# EAGLE design Joulev2_RealTime (EAGLE 8.1.1)

## Sheet 1 of 3
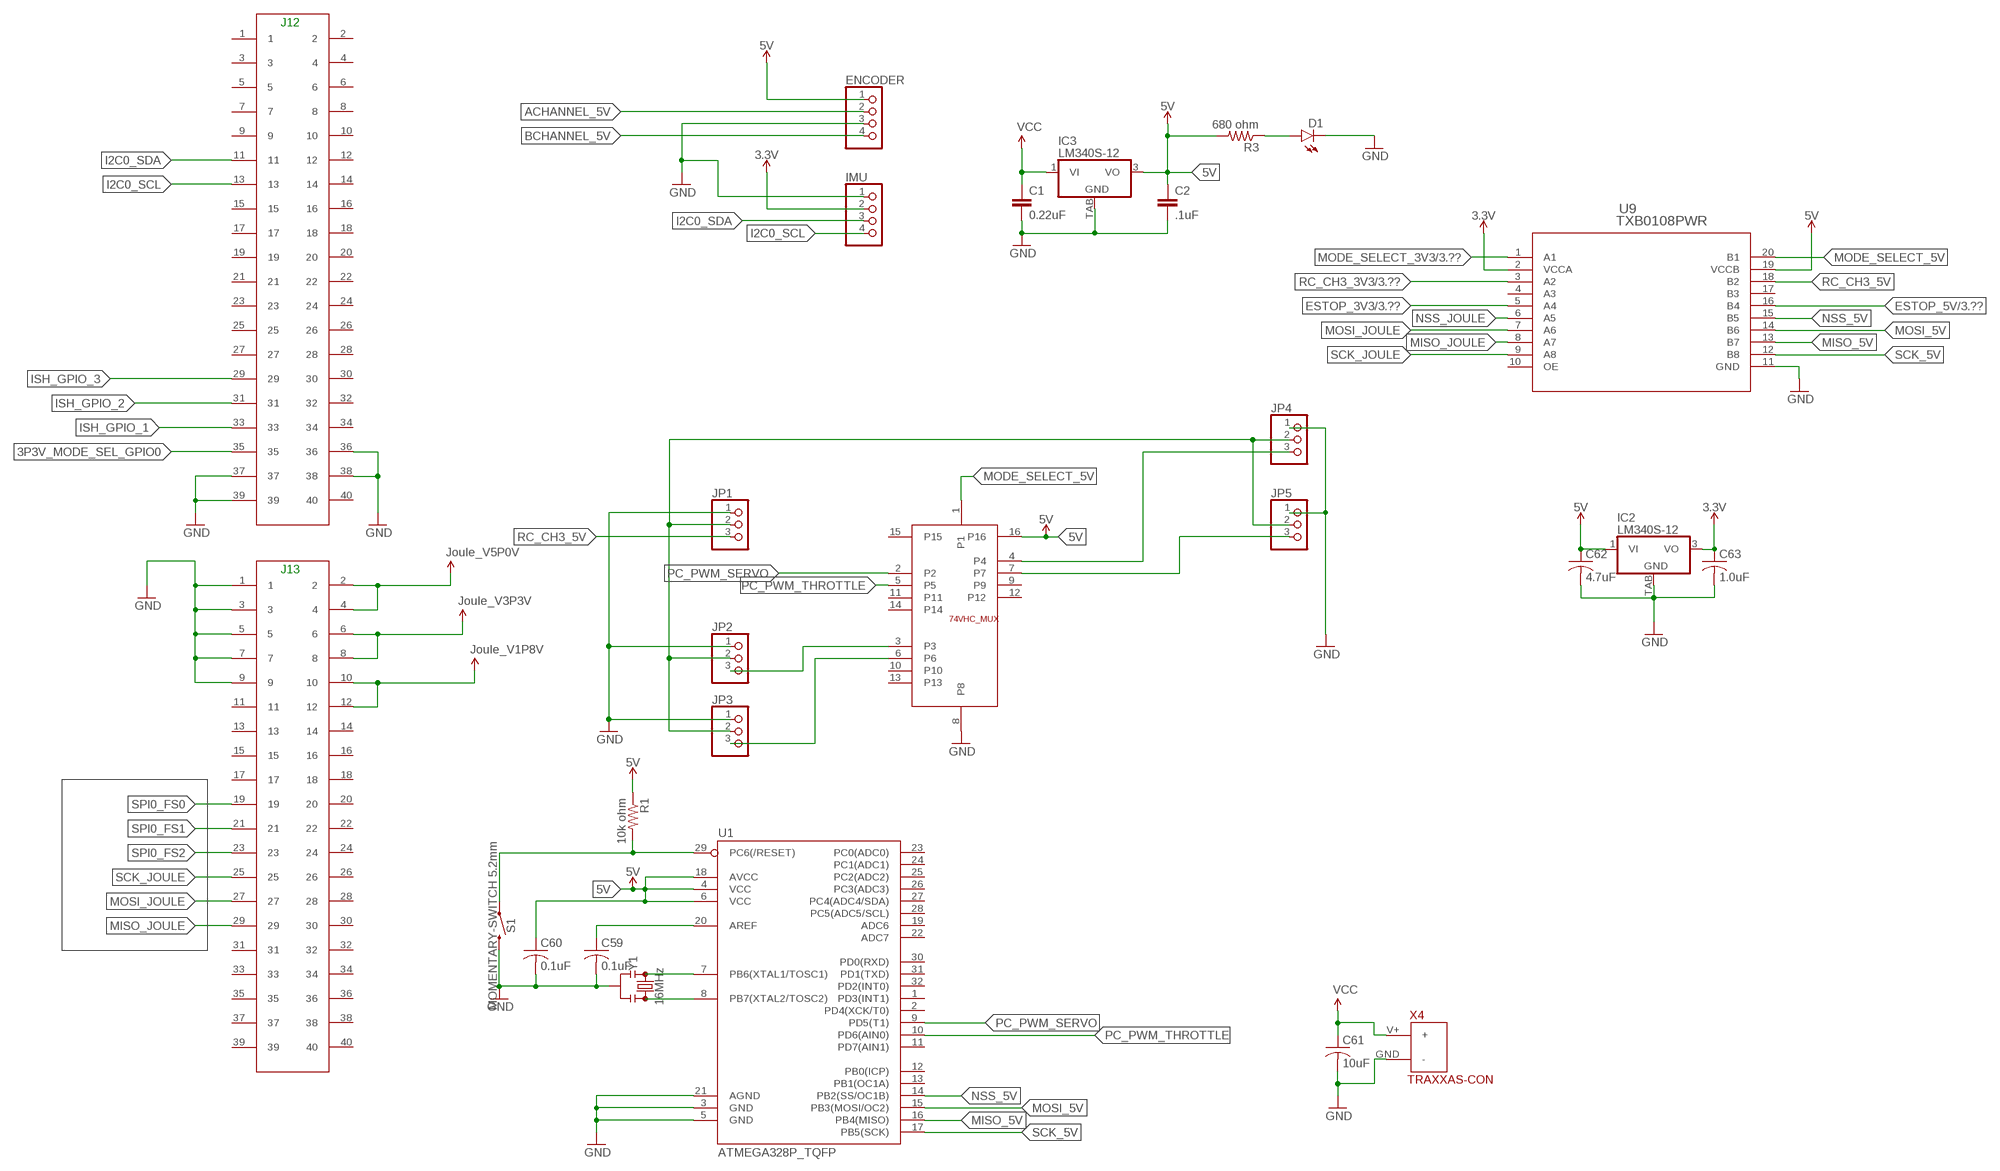
[diagram p0: schematic, sheet 1]

### Parts
C1  0.22uF  0.22UF-25V-10%(0603)  [0603-CAP]
C2  .1uF  0.22UF-25V-10%(0603)  [0603-CAP]
C59  0.1uF  C-USC0603  [C0603]
C60  0.1uF  C-USC0603  [C0603]
C61  10uF  C-USC0603  [C0603]
C62  4.7uF  C-USC0603  [C0603]
C63  1.0uF  C-USC0603  [C0603]
D1  LED0603  [LED-0603]
ENCODER  PINHD-1X4  [1X04]
IC2  LM340S-12  [TO263-3]
IC3  LM340S-12  [TO263-3]
IMU  PINHD-1X4  [1X04]
JP1  PINHD-1X3  [1X03]
JP2  PINHD-1X3  [1X03]
JP3  PINHD-1X3  [1X03]
JP4  PINHD-1X3  [1X03]
JP5  PINHD-1X3  [1X03]
R1  10k ohm  R-US_R0603  [R0603]
R3  680 ohm  R-US_R0603  [R0603]
S1  MOMENTARY-SWITCH 5.2mm  MOMENTARY-SWITCH-SPST-SMD-5.2MM  [TACTILE_SWITCH_SMD_5.2MM]
U1  ATMEGA328P_TQFP  [TQFP32-08]
U2  74VHC_MUXSO16  [SO16]
U9  TXB0108PWR  [PW20]
X1  J12HEADER_(JOULE)  [2X20]
X2  J13HEADER_(JOULE)  [2X20]
X4  TRAXXAS-CON  [TRAXXAS-CON]
Y1  16MHz  RESONATOR-16MHZSMD_3.2X1.3  [RESONATOR-SMD-3.2X1.3]

### Nets
3.3V: C63.1 IC2.3(VO) IMU.2 U9.2(VCCA) ; also sheet 2,3
3P3V_MODE_SEL_GPIO0: X1.35
5V: C2.1 C60.1 C62.1 ENCODER.1 IC2.1(VI) IC3.3(VO) R1.1 R3.2 U1.4(VCC) U1.6(VCC) U1.18(AVCC) U2.16 U9.19(VCCB)
ACHANNEL_5V: ENCODER.2
BCHANNEL_5V: ENCODER.4
ESTOP_3V3: U9.5(A4) ; also sheet 3
ESTOP_5V: U9.16(B4) ; also sheet 3
GND: C1.2 C2.2 C59.2 C60.2 C61.2 C62.2 C63.2 D1.C ENCODER.3 IC2.TAB(GND) IC3.TAB(GND) IMU.1 JP1.1 JP2.1 JP3.1 JP4.1 JP5.1 S1.3 U1.3(GND) U1.5(GND) U1.21(AGND) U2.8 U9.11(GND) X1.36 X1.37 X1.38 X1.39 X2.1 X2.3 X2.5 X2.7 X2.9 X4.GND(-) Y1.2 ; also sheet 2,3
I2C0_SCL: IMU.4 X1.13
I2C0_SDA: IMU.3 X1.11
ISH_GPIO_1: X1.33
ISH_GPIO_2: X1.31
ISH_GPIO_3: X1.29
MISO_5V: U1.16(PB4(MISO)) U9.13(B7)
MISO_JOULE: U9.8(A7) X2.29
MODE_SELECT_3V3: U9.1(A1) ; also sheet 3
MODE_SELECT_5V: U2.1 U9.20(B1)
MOSI_5V: U1.15(PB3(MOSI/OC2)) U9.14(B6)
MOSI_JOULE: U9.7(A6) X2.27
N$2: JP4.3 U2.4
N$3: JP5.3 U2.7
N$4: R1.2 S1.1 U1.29(PC6(/RESET))
N$6: U1.7(PB6(XTAL1/TOSC1)) Y1.1
N$7: JP1.2 JP2.2 JP3.2 JP4.2 JP5.2
N$8: U1.8(PB7(XTAL2/TOSC2)) Y1.3
N$10: JP2.3 U2.3
N$11: JP3.3 U2.6
N$13: C59.1 U1.20(AREF)
N$20: D1.A R3.1
NSS_5V: U1.14(PB2(SS/OC1B)) U9.15(B5)
NSS_JOULE: U9.6(A5)
PC_PWM_SERVO: U1.9(PD5(T1)) U2.2
PC_PWM_THROTTLE: U1.10(PD6(AIN0)) U2.5
RC_CH3_3V3: U9.3(A2) ; also sheet 3
RC_CH3_5V: JP1.3 U9.18(B2)
SCK_5V: U1.17(PB5(SCK)) U9.12(B8)
SCK_JOULE: U9.9(A8) X2.25
SPI0_FS0: X2.19
SPI0_FS1: X2.21
SPI0_FS2: X2.23
V1P8V: X2.10 X2.12 ; supply symbol labelled Joule_V1P8V
V3P3V: X2.6 X2.8 ; supply symbol labelled Joule_V3P3V
V5P0V: X2.2 X2.4 ; supply symbol labelled Joule_V5P0V
VCC: C1.1 C61.1 IC3.1(VI) X4.V+(+) ; also sheet 3
Unconnected: U1.1(PD3(INT1)) U1.2(PD4(XCK/T0)) U1.11(PD7(AIN1)) U1.12(PB0(ICP)) U1.13(PB1(OC1A)) U1.19(ADC6) U1.22(ADC7) U1.23(PC0(ADC0)) U1.24(PC1(ADC1)) U1.25(PC2(ADC2)) U1.26(PC3(ADC3)) U1.27(PC4(ADC4/SDA)) U1.28(PC5(ADC5/SCL)) U1.30(PD0(RXD)) U1.31(PD1(TXD)) U1.32(PD2(INT0)) U2.9 U2.10 U2.11 U2.12 U2.13 U2.14 U2.15 U9.4(A3) U9.10(OE) U9.17(B3) X1.1 X1.2 X1.3 X1.4 X1.5 X1.6 X1.7 X1.8 X1.9 X1.10 X1.12 X1.14 X1.15 X1.16 X1.17 X1.18 X1.19 X1.20 X1.21 X1.22 X1.23 X1.24 X1.25 X1.26 X1.27 X1.28 X1.30 X1.32 X1.34 X1.40 X2.11 X2.13 X2.14 X2.15 X2.16 X2.17 X2.18 X2.20 X2.22 X2.24 X2.26 X2.28 X2.30 X2.31 X2.32 X2.33 X2.34 X2.35 X2.36 X2.37 X2.38 X2.39 X2.40

### Notes on the sheet
- J12
- J13

## Sheet 2 of 3: USB Hub
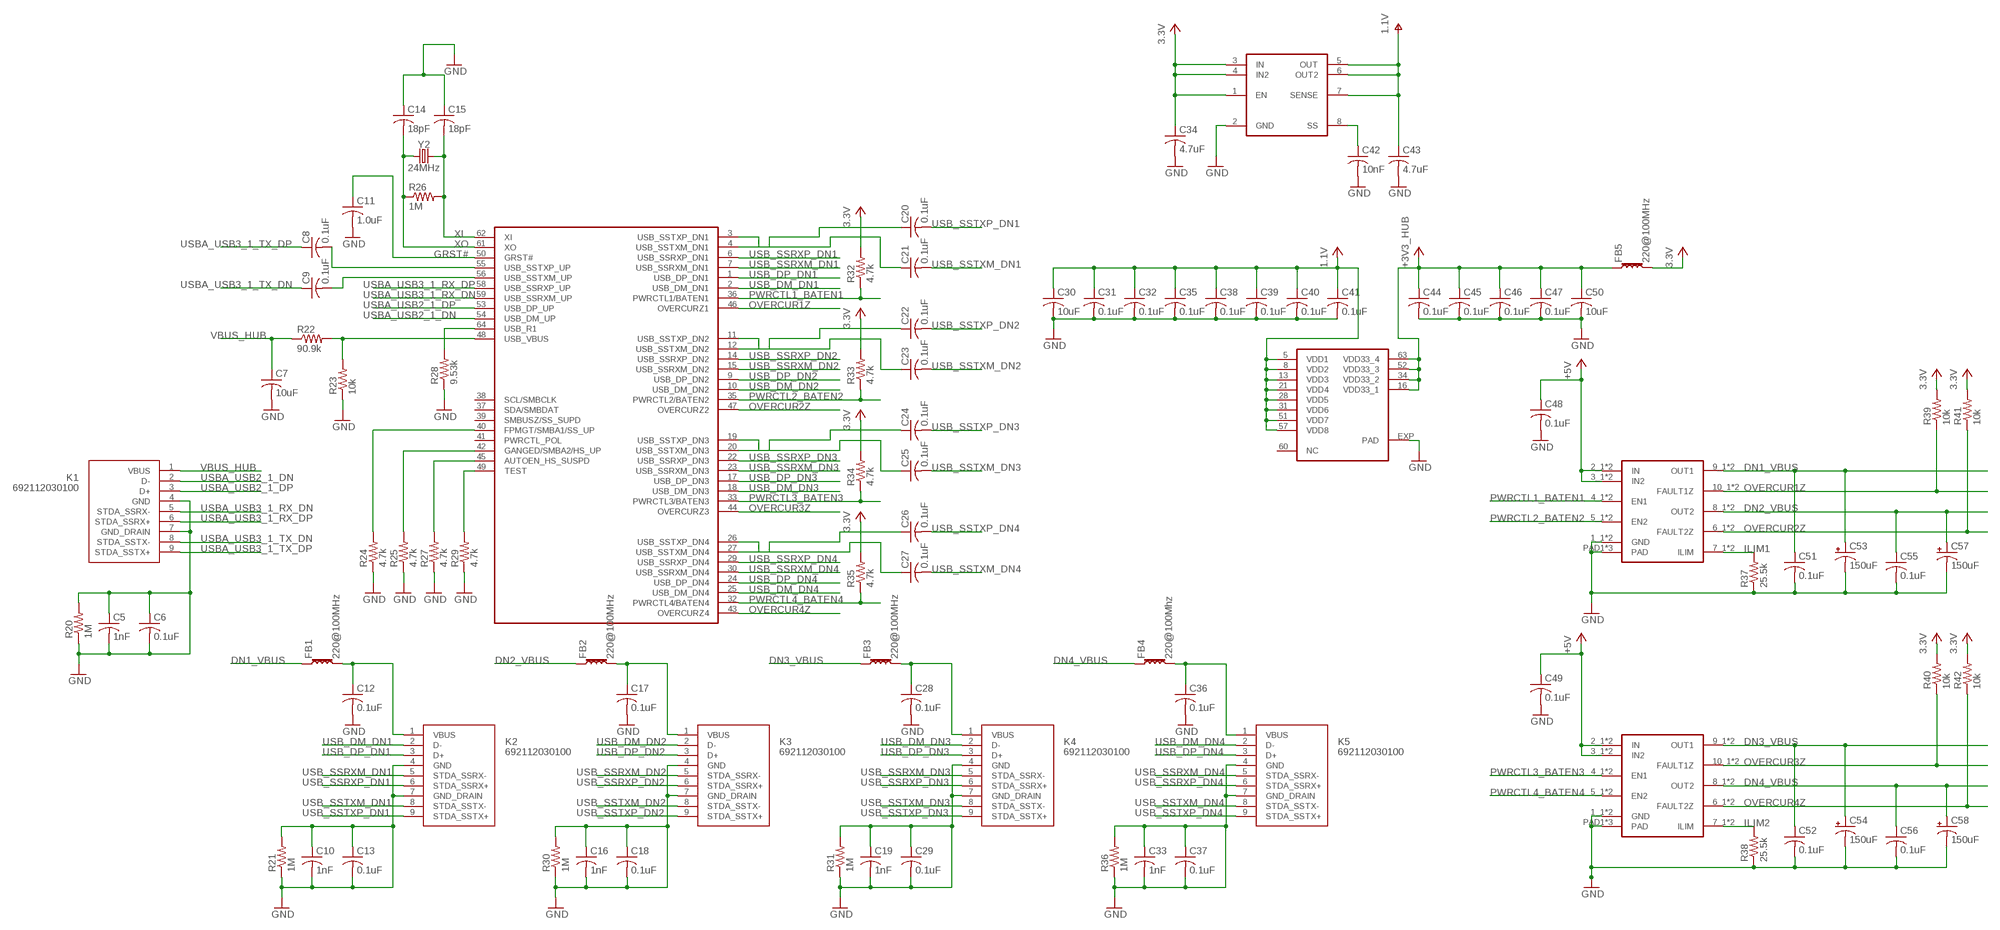
[diagram p1: schematic, sheet 2]

### Parts
C5  1nF  C-USC0603  [C0603]
C6  0.1uF  C-USC0603  [C0603]
C7  10uF  C-USC0603  [C0603]
C8  0.1uF  C-USC0402  [C0402]
C9  0.1uF  C-USC0402  [C0402]
C10  1nF  C-USC0603  [C0603]
C11  1.0uF  C-USC0603  [C0603]
C12  0.1uF  C-USC0603  [C0603]
C13  0.1uF  C-USC0603  [C0603]
C14  18pF  C-USC0603  [C0603]
C15  18pF  C-USC0603  [C0603]
C16  1nF  C-USC0603  [C0603]
C17  0.1uF  C-USC0603  [C0603]
C18  0.1uF  C-USC0603  [C0603]
C19  1nF  C-USC0603  [C0603]
C20  0.1uF  C-USC0402  [C0402]
C21  0.1uF  C-USC0402  [C0402]
C22  0.1uF  C-USC0402  [C0402]
C23  0.1uF  C-USC0402  [C0402]
C24  0.1uF  C-USC0402  [C0402]
C25  0.1uF  C-USC0402  [C0402]
C26  0.1uF  C-USC0402  [C0402]
C27  0.1uF  C-USC0402  [C0402]
C28  0.1uF  C-USC0603  [C0603]
C29  0.1uF  C-USC0603  [C0603]
C30  10uF  C-USC0603  [C0603]
C31  0.1uF  C-USC0603  [C0603]
C32  0.1uF  C-USC0603  [C0603]
C33  1nF  C-USC0603  [C0603]
C34  4.7uF  C-USC0603  [C0603]
C35  0.1uF  C-USC0603  [C0603]
C36  0.1uF  C-USC0603  [C0603]
C37  0.1uF  C-USC0603  [C0603]
C38  0.1uF  C-USC0603  [C0603]
C39  0.1uF  C-USC0603  [C0603]
C40  0.1uF  C-USC0603  [C0603]
C41  0.1uF  C-USC0603  [C0603]
C42  10nF  C-USC0603  [C0603]
C43  4.7uF  C-USC0603  [C0603]
C44  0.1uF  C-USC0603  [C0603]
C45  0.1uF  C-USC0603  [C0603]
C46  0.1uF  C-USC0603  [C0603]
C47  0.1uF  C-USC0603  [C0603]
C48  0.1uF  C-USC0603  [C0603]
C49  0.1uF  C-USC0603  [C0603]
C50  10uF  C-USC0603  [C0603]
C51  0.1uF  C-USC0603  [C0603]
C52  0.1uF  C-USC0603  [C0603]
C53  150uF  100UF-POLAR-RADIAL-2.5MM-25V-20%  [CPOL-RADIAL-2.5MM-6.5MM]
C54  150uF  100UF-POLAR-RADIAL-2.5MM-25V-20%  [CPOL-RADIAL-2.5MM-6.5MM]
C55  0.1uF  C-USC0603  [C0603]
C56  0.1uF  C-USC0603  [C0603]
C57  150uF  100UF-POLAR-RADIAL-2.5MM-25V-20%  [CPOL-RADIAL-2.5MM-6.5MM]
C58  150uF  100UF-POLAR-RADIAL-2.5MM-25V-20%  [CPOL-RADIAL-2.5MM-6.5MM]
FB1  220@100MHz  FERRITE_BEAD-0603  [0603]
FB2  220@100MHz  FERRITE_BEAD-0603  [0603]
FB3  220@100MHz  FERRITE_BEAD-0603  [0603]
FB4  220@100Mhz  FERRITE_BEAD-0603  [0603]
FB5  220@100MHz  FERRITE_BEAD-0603  [0603]
K1  692112030100  [692112030100]
K2  692112030100  [692112030100]
K3  692112030100  [692112030100]
K4  692112030100  [692112030100]
K5  692112030100  [692112030100]
R20  1M  R-US_R0603  [R0603]
R21  1M  R-US_R0603  [R0603]
R22  90.9k  R-US_R0603  [R0603]
R23  10k  R-US_R0603  [R0603]
R24  4.7k  R-US_R0603  [R0603]
R25  4.7k  R-US_R0603  [R0603]
R26  1M  R-US_R0603  [R0603]
R27  4.7k  R-US_R0603  [R0603]
R28  9.53k  R-US_R0603  [R0603]
R29  4.7k  R-US_R0603  [R0603]
R30  1M  R-US_R0603  [R0603]
R31  1M  R-US_R0603  [R0603]
R32  4.7k  R-US_R0603  [R0603]
R33  4.7k  R-US_R0603  [R0603]
R34  4.7k  R-US_R0603  [R0603]
R35  4.7k  R-US_R0603  [R0603]
R36  1M  R-US_R0603  [R0603]
R37  25.5k  R-US_R0603  [R0603]
R38  25.5k  R-US_R0603  [R0603]
R39  10k  R-US_R0603  [R0603]
R40  10k  R-US_R0603  [R0603]
R41  10k  R-US_R0603  [R0603]
R42  10k  R-US_R0603  [R0603]
U4  TUSB8041  [QFN64-9X9]
U5  ADP1706ARDZ-1.1-R7  [SOIC8]
U6  TPS2561DRCT  [10-VSON]
U7  TPS2561DRCT  [10-VSON]
Y2  24MHz  CRYSTAL-24MHZ"  [CRYSTAL-SMD-5X3.2-4PAD]

### Nets
1.1V: C30.1 C31.1 C32.1 C35.1 C38.1 C39.1 C40.1 C41.1 C43.1 U4.5(VDD1) U4.8(VDD2) U4.13(VDD3) U4.21(VDD4) U4.28(VDD5) U4.31(VDD6) U4.51(VDD7) U4.57(VDD8) U5.5(OUT) U5.6(OUT2) U5.7(SENSE)
3.3V: C34.1 FB5.2 R32.2 R33.2 R34.2 R35.2 R39.2 R40.2 R41.2 R42.2 U5.1(EN) U5.3(IN) U5.4(IN2) ; also sheet 1,3
+3V3_HUB: C44.1 C45.1 C46.1 C47.1 C50.1 FB5.1 U4.16(VDD33_1) U4.34(VDD33_2) U4.52(VDD33_3) U4.63(VDD33_4)
+5V: C48.1 C49.1 U6.2_1(IN) U6.2_2(IN) U6.3_1(IN2) U6.3_2(IN2) U7.2_1(IN) U7.2_2(IN) U7.3_1(IN2) U7.3_2(IN2)
DN1_VBUS: C51.1 C53.1(+) FB1.1 U6.9_1(OUT1) U6.9_2(OUT1)
DN2_VBUS: C55.1 C57.1(+) FB2.1 U6.8_1(OUT2) U6.8_2(OUT2)
DN3_VBUS: C52.1 C54.1(+) FB3.1 U7.9_1(OUT1) U7.9_2(OUT1)
DN4_VBUS: C56.1 C58.1(+) FB4.1 U7.8_1(OUT2) U7.8_2(OUT2)
GND: C5.1 C5.2 C6.1 C6.2 C7.2 C10.1 C10.2 C11.2 C12.2 C13.1 C13.2 C14.1 C15.1 C16.1 C16.2 C17.2 C18.1 C18.2 C19.1 C19.2 C28.2 C29.1 C29.2 C30.2 C31.2 C32.2 C33.1 C33.2 C34.2 C35.2 C36.2 C37.1 C37.2 C38.2 C39.2 C40.2 C41.2 C42.2 C43.2 C44.2 C45.2 C46.2 C47.2 C48.2 C49.2 C50.2 C51.2 C52.2 C53.2(-) C54.2(-) C55.2 C56.2 C57.2(-) C58.2(-) K1.4(GND) K1.7(GND_DRAIN) K2.4(GND) K2.7(GND_DRAIN) K3.4(GND) K3.7(GND_DRAIN) K4.4(GND) K4.7(GND_DRAIN) K5.4(GND) K5.7(GND_DRAIN) R20.1 R20.2 R21.1 R21.2 R23.1 R24.1 R25.1 R27.1 R28.1 R29.1 R30.1 R30.2 R31.1 R31.2 R36.1 R36.2 R37.1 R38.1 U4.EXP(PAD) U5.2(GND) U6.1_1(GND) U6.1_2(GND) U6.PAD1(PAD) U6.PAD2(PAD) U6.PAD3(PAD) U7.1_1(GND) U7.1_2(GND) U7.PAD1(PAD) U7.PAD2(PAD) U7.PAD3(PAD) ; also sheet 1,3
GRST#: C11.1 U4.50(GRST#)
ILIM1: R37.2 U6.7_1(ILIM) U6.7_2(ILIM)
ILIM2: R38.2 U7.7_1(ILIM) U7.7_2(ILIM)
N$9: R28.2 U4.64(USB_R1)
N$18: R29.2 U4.49(TEST)
N$22: R27.2 U4.45(AUTOEN_HS_SUSPD)
N$23: R25.2 U4.42(GANGED/SMBA2/HS_UP)
N$24: R24.2 U4.40(FPMGT/SMBA1/SS_UP)
N$25: R22.2 R23.2 U4.48(USB_VBUS)
N$26: C27.1 U4.26(USB_SSTXP_DN4)
N$27: C26.1 U4.27(USB_SSTXM_DN4)
N$28: C25.1 U4.19(USB_SSTXP_DN3)
N$29: C24.1 U4.20(USB_SSTXM_DN3)
N$30: C23.1 U4.11(USB_SSTXP_DN2)
N$31: C22.1 U4.12(USB_SSTXM_DN2)
N$32: C21.1 U4.3(USB_SSTXP_DN1)
N$33: C20.1 U4.4(USB_SSTXM_DN1)
N$35: C12.1 FB1.2 K2.1(VBUS)
N$36: C42.1 U5.8(SS)
N$38: C17.1 FB2.2 K3.1(VBUS)
N$40: C28.1 FB3.2 K4.1(VBUS)
N$73: C36.1 FB4.2 K5.1(VBUS)
OVERCUR1Z: R39.1 U4.46(OVERCURZ1) U6.10_1(FAULT1Z) U6.10_2(FAULT1Z)
OVERCUR2Z: R41.1 U4.47(OVERCURZ2) U6.6_1(FAULT2Z) U6.6_2(FAULT2Z)
OVERCUR3Z: R40.1 U4.44(OVERCURZ3) U7.10_1(FAULT1Z) U7.10_2(FAULT1Z)
OVERCUR4Z: R42.1 U4.43(OVERCURZ4) U7.6_1(FAULT2Z) U7.6_2(FAULT2Z)
PWRCTL1_BATEN1: R32.1 U4.36(PWRCTL1/BATEN1) U6.4_1(EN1) U6.4_2(EN1)
PWRCTL2_BATEN2: R33.1 U4.35(PWRCTL2/BATEN2) U6.5_1(EN2) U6.5_2(EN2)
PWRCTL3_BATEN3: R34.1 U4.33(PWRCTL3/BATEN3) U7.4_1(EN1) U7.4_2(EN1)
PWRCTL4_BATEN4: R35.1 U4.32(PWRCTL4/BATEN4) U7.5_1(EN2) U7.5_2(EN2)
USB_DM_DN1: K2.2(D-) U4.2(USB_DM_DN1)
USB_DM_DN2: K3.2(D-) U4.10(USB_DM_DN2)
USB_DM_DN3: K4.2(D-) U4.18(USB_DM_DN3)
USB_DM_DN4: K5.2(D-) U4.25(USB_DM_DN4)
USB_DP_DN1: K2.3(D+) U4.1(USB_DP_DN1)
USB_DP_DN2: K3.3(D+) U4.9(USB_DP_DN2)
USB_DP_DN3: K4.3(D+) U4.17(USB_DP_DN3)
USB_DP_DN4: K5.3(D+) U4.24(USB_DP_DN4)
USB_SSRXM_DN1: K2.5(STDA_SSRX-) U4.7(USB_SSRXM_DN1)
USB_SSRXM_DN2: K3.5(STDA_SSRX-) U4.15(USB_SSRXM_DN2)
USB_SSRXM_DN3: K4.5(STDA_SSRX-) U4.23(USB_SSRXM_DN3)
USB_SSRXM_DN4: K5.5(STDA_SSRX-) U4.30(USB_SSRXM_DN4)
USB_SSRXP_DN1: K2.6(STDA_SSRX+) U4.6(USB_SSRXP_DN1)
USB_SSRXP_DN2: K3.6(STDA_SSRX+) U4.14(USB_SSRXP_DN2)
USB_SSRXP_DN3: K4.6(STDA_SSRX+) U4.22(USB_SSRXP_DN3)
USB_SSRXP_DN4: K5.6(STDA_SSRX+) U4.29(USB_SSRXP_DN4)
USB_SSTXM_DN1: C21.2 K2.8(STDA_SSTX-)
USB_SSTXM_DN2: C23.2 K3.8(STDA_SSTX-)
USB_SSTXM_DN3: C25.2 K4.8(STDA_SSTX-)
USB_SSTXM_DN4: C27.2 K5.8(STDA_SSTX-)
USB_SSTXP_DN1: C20.2 K2.9(STDA_SSTX+)
USB_SSTXP_DN2: C22.2 K3.9(STDA_SSTX+)
USB_SSTXP_DN3: C24.2 K4.9(STDA_SSTX+)
USB_SSTXP_DN4: C26.2 K5.9(STDA_SSTX+)
USBA_USB2_1_DN: K1.2(D-) U4.54(USB_DM_UP)
USBA_USB2_1_DP: K1.3(D+) U4.53(USB_DP_UP)
USBA_USB3_1_RX_DN: K1.5(STDA_SSRX-) U4.59(USB_SSRXM_UP)
USBA_USB3_1_RX_DP: K1.6(STDA_SSRX+) U4.58(USB_SSRXP_UP)
USBA_USB3_1_TX_DN: C9.1 K1.8(STDA_SSTX-)
USBA_USB3_1_TX_DP: C8.1 K1.9(STDA_SSTX+)
VBUS_HUB: C7.1 K1.1(VBUS) R22.1
X: C8.2 U4.55(USB_SSTXP_UP)
XI: C15.2 R26.2 U4.62(XI) Y2.3
XO: C14.2 R26.1 U4.61(XO) Y2.1
Y: C9.2 U4.56(USB_SSTXM_UP)
Unconnected: U4.37(SDA/SMBDAT) U4.38(SCL/SMBCLK) U4.39(SMBUSZ/SS_SUPD) U4.41(PWRCTL_POL) U4.60(NC)

## Sheet 3 of 3: E-stop
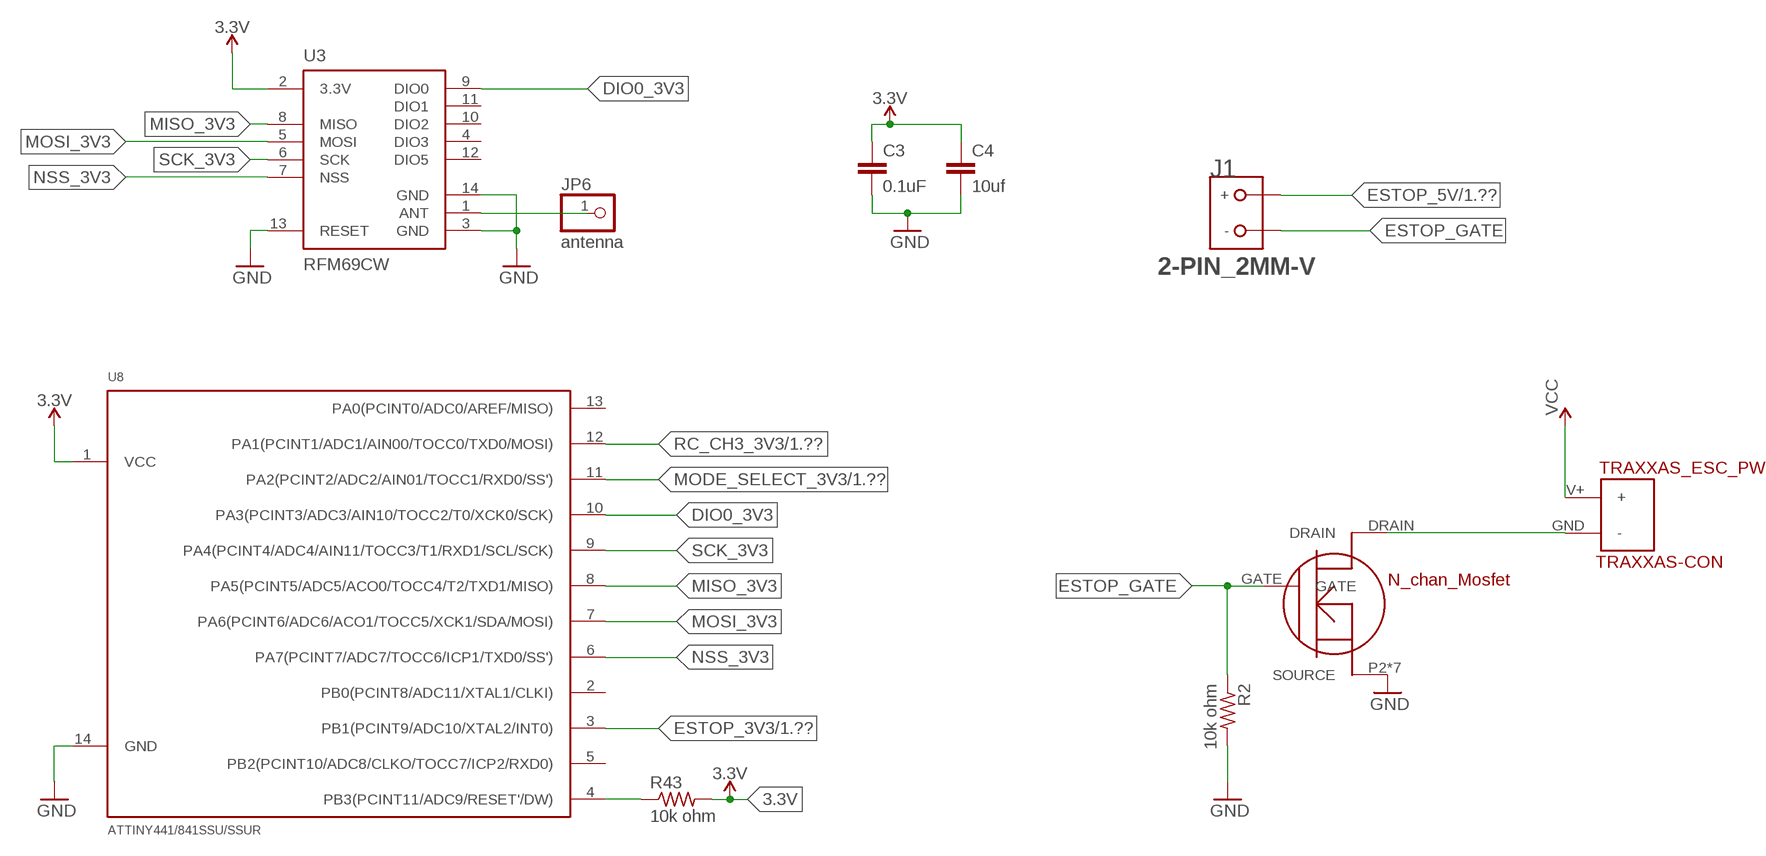
[diagram p2: schematic, sheet 3]

### Parts
C3  0.1uF  0.1UF-25V(+80/-20%)(0603)  [0603-CAP]
C4  10uf  2.2UF-25V-+80/-20(0805)  [0805@1]
J1  2-PIN_2MM-V  [2MM-2-V]
JP6  antenna  PINHD-1X1  [1X01]
Q1  N_CH_MOSFET_FDLBL260N100  [MO-299A]
R2  10k ohm  R-US_R0603  [R0603]
R43  10k ohm  R-US_R0603  [R0603]
TRAXXAS_ESC_PWR  TRAXXAS-CON  [TRAXXAS-CON]
U3  RFM69CW  [RFM69CW-XXXS2]
U8  ATTINY441/841SSU/SSUR  [SOIC-14]

### Nets
3.3V: C3.1 C4.1 R43.2 U3.2(3.3V) U8.1(VCC) ; also sheet 1,2
DIO0_3V3: U3.9(DIO0) U8.10(PA3(PCINT3/ADC3/AIN10/TOCC2/T0/XCK0/SCK))
ESTOP_3V3: U8.3(PB1(PCINT9/ADC10/XTAL2/INT0)) ; also sheet 1
ESTOP_5V: J1.1(+) ; also sheet 1
ESTOP_GATE: J1.2(-) Q1.GATE R2.1
GND: C3.2 C4.2 Q1.P2(SOURCE) Q1.P3(SOURCE) Q1.P4(SOURCE) Q1.P5(SOURCE) Q1.P6(SOURCE) Q1.P7(SOURCE) Q1.P8(SOURCE) R2.2 U3.3(GND) U3.13(RESET) U3.14(GND) U8.14(GND) ; also sheet 1,2
MISO_3V3: U3.8(MISO) U8.8(PA5(PCINT5/ADC5/ACO0/TOCC4/T2/TXD1/MISO))
MODE_SELECT_3V3: U8.11(PA2(PCINT2/ADC2/AIN01/TOCC1/RXD0/SS')) ; also sheet 1
MOSI_3V3: U3.5(MOSI) U8.7(PA6(PCINT6/ADC6/ACO1/TOCC5/XCK1/SDA/MOSI))
N$1: JP6.1 U3.1(ANT)
N$5: TRAXXAS_ESC_PWR.GND(-)
N$12: R43.1 U8.4(PB3(PCINT11/ADC9/RESET'/DW))
NSS_3V3: U3.7(NSS) U8.6(PA7(PCINT7/ADC7/TOCC6/ICP1/TXD0/SS'))
RC_CH3_3V3: U8.12(PA1(PCINT1/ADC1/AIN00/TOCC0/TXD0/MOSI)) ; also sheet 1
SCK_3V3: U3.6(SCK) U8.9(PA4(PCINT4/ADC4/AIN11/TOCC3/T1/RXD1/SCL/SCK))
VCC: TRAXXAS_ESC_PWR.V+(+) ; also sheet 1
Unconnected: Q1.DRAIN U3.4(DIO3) U3.10(DIO2) U3.11(DIO1) U3.12(DIO5) U8.2(PB0(PCINT8/ADC11/XTAL1/CLKI)) U8.5(PB2(PCINT10/ADC8/CLKO/TOCC7/ICP2/RXD0)) U8.13(PA0(PCINT0/ADC0/AREF/MISO))

## Library data of the parts
C1 = SparkFun-Capacitors:0.22UF-25V-10%(0603): CAP-07822; PROD_ID: CAP-07822
C2 = SparkFun-Capacitors:0.22UF-25V-10%(0603): CAP-07822; PROD_ID: CAP-07822; VALUE: 0.22uF
C3 = SparkFun-Capacitors:0.1UF-25V(+80/-20%)(0603): CAP-00810 Ceramic Standard decoupling cap; PROD_ID: CAP-00810
C4 = SparkFun-Capacitors:2.2UF-25V-+80/-20(0805): CAP-11624; PROD_ID: CAP-11624; VALUE: 2.2uF
C5-C52 C55 C56 C59-C63 = rcl:C-US: CAPACITOR, American symbol
C53 C54 C57 C58 = SparkFun-Capacitors:100UF-POLAR: 100µF polarized capacitors A capacitor is a passive two-terminal electrical component used to store electrical energy temporarily in an electric field.; PROD_ID: CAP-08439; VALUE: 100uF
D1 = SparkFun-LED:LED: LEDs Standard schematic elements and footprints for 5mm, 3mm, 1206, and 0603 sized LEDs. 5mm - Spark Fun Electronics SKU : COM-00529 (and others)
ENCODER IMU = pinhead:PINHD-1X4: PIN HEADER
FB1-FB5 = SparkFun-Coils:FERRITE_BEAD: Ferrite Bead (blocks, cores, rings, chokes, etc.) Inductor with layers of ferrite used to suppress high frequencies. Often used to isolate high frequency noise. SparkFun Products: IOIO-OTG - V2.2 <https://www.sparkfun.com/products/13613> SparkFun SAMD21 Mini Breakout <https://www.sparkfun.com/products/13664> SparkFun 6 Degrees of Freedom Breakout - LSM6DS3 <https://www.sparkfun.com/products/13339> SparkFun SAMD21 Dev Breakout <https://www.sparkfun.com/products/13672>; PROD_ID: NDUC-07859; VALUE: 30Ω/1.8A
IC2 IC3 = linear:LM340?-*: Positive VOLTAGE REGULATOR Source: http://cache.national.com/ds/LM/LM340.pdf
J1 = RoboJackets-Connectors:2-PIN_2MM-*; PINS: 2; PIN_PITCH: 2.0 mm
JP1-JP5 = adafruit:PINHD-1X3: PIN HEADER
JP6 = adafruit:PINHD-1X1: Pin header 1x1 for 0.1" spacing With round pins
K1-K5 = Roboracing:692112030100: WR-COM USB 3.0 SMT PLUG WITH CLIPTYPE A
Q1 = Roboracing:N_CH_MOSFET_FDLBL260N100
R1-R3 R20-R43 = rcl:R-US_: RESISTOR, American symbol
S1 = Roboracing:MOMENTARY-SWITCH-SPST: Momentary Switch (Pushbutton) - SPST Normally-open (NO) SPST momentary switches (buttons, pushbuttons). Variants PTH-12MM - 12mm square, through-hole Momentary Pushbutton Switch - 12mm Square <https://www.sparkfun.com/products/9190> (COM-09190) PTH-6.0MM, PTH-6.0MM-KIT - 6.0mm square, through-hole Mini Pushbutton Switch <https://www.sparkfun.com/products/97> (COM-00097) KIT package intended for soldering kit's - only one side of pads' copper is exposed. PTH-RIGHT-ANGLE-KIT - Right-angle, through-hole Right Angle Tactile Button <https://www.sparkfun.com/products/10791> - Used on SparkFun BigTime Watch Kit <https://www.sparkfun.com/products/11734> SMD-12MM - 12mm square, surface-mount Tactile Button - SMD (12mm) <https://www.sparkfun.com/products/12993> (COM-12993) Used on SparkFun PicoBoard <https://www.sparkfun.com/products/11888> SMD-4.5MM - 4.5mm Square Trackball Switch Used on SparkFun Blackberry Trackballer Breakout <https://www.sparkfun.com/products/13169> SMD-4.6MMX2.8MM - 4.60mm x 2.80mm, surface mount Used on SparkFun SAMD21 Mini Breakout <https://www.sparkfun.com/products/13664> SMD-5.2MM, SMD-5.2-REDUNDANT - 5.2mm square, surface-mount Mini Pushbutton Switch - SMD <https://www.sparkfun.com/products/8720> (COM-08720) Used on Arduino Pro Mini <https://www.sparkfun.com/products/11114> REDUNDANT package connects both switch circuits together SMD-6.0X3.5MM - 6.0 x 3.5mm, surface mount Momentary Reset Switch SMD <https://www.sparkfun.com/products/8229> (COM-08229) SMD-6.2MM-TALL - 6.2mm square, surface mount Tactile Button - SMD (6mm) <https://www.sparkfun.com/products/12992> Used on SparkFun Digital Sandbox <https://www.sparkfun.com/products/12651> SMD-RIGHT-ANGLE - Right-angle, surface mount Used on SparkFun Block for Intel® Edison - Arduino <https://www.sparkfun.com/products/13036>; PROD_ID: SWCH-08247; SF_SKU: COM-08720
TRAXXAS_ESC_PWR X4 = Roboracing:TRAXXAS-CON
U1 = SparkFun-IC-Microcontroller:ATMEGA328P_TQFP: Popular 328P in QFP Storefront component: ATmega328 - TQFP <https://www.sparkfun.com/products/13448> (COM-13448) Datasheet <http://www.sparkfun.com/datasheets/Components/SMD/ATMega328.pdf> SparkFun Products SparkFun RedBoard - Programmed with Arduino <https://www.sparkfun.com/products/12757> (DEV-12757) Arduino Pro Mini 328 - 5V/16MHz <https://www.sparkfun.com/products/11113> (DEV-11113) Arduino Pro Mini 328 - 3.3V/8MHz <https://www.sparkfun.com/products/11114> (DEV-11114) SparkFun OpenLog <https://www.sparkfun.com/products/13712> (DEV-13712) SparkFun MicroView - OLED Arduino Module <https://www.sparkfun.com/products/12923> (DEV-12923) SparkFun Digital Sandbox <https://www.sparkfun.com/products/12651> (DEV-12651) SparkFun PicoBoard <https://www.sparkfun.com/products/11888> (WIG-11888) Arduino Fio <https://www.sparkfun.com/products/10116> (DEV-10116) LilyPad Arduino 328 Main Board <https://www.sparkfun.com/products/13342> (DEV-13342) SparkFun RedStick <https://www.sparkfun.com/products/13741> (DEV-13741) LilyPad MP3 <https://www.sparkfun.com/products/11013> (DEV-11013) LilyPad Arduino SimpleSnap <https://www.sparkfun.com/products/10941> (DEV-10941) SparkFun Stepoko <https://www.sparkfun.com/products/13899> (ROB-13899) SparkFun Geiger Counter <https://www.sparkfun.com/products/11345> (SEN-11345) SparkFun EL Sequencer <https://www.sparkfun.com/products/12781> (COM-12781) Arduino Pro 328 - 5V/16MHz <https://www.sparkfun.com/products/10915> (DEV-10915) CryptoCape <https://www.sparkfun.com/products/12773> (DEV-12773) SparkFun IR Thermometer Evaluation Board - MLX90614 <https://www.sparkfun.com/products/10740> (SEN-10740) SparkFun RedBot Mainboard <https://www.sparkfun.com/products/12097> (ROB-12097) Arduino Pro 328 - 3.3V/8MHz <https://www.sparkfun.com/products/10914> (DEV-10914) SparkFun Block for Intel® Edison - Arduino <https://www.sparkfun.com/products/13036> (DEV-13036) SparkFun Simon Says - Surface Mount Soldering Kit <https://www.sparkfun.com/products/10935> (KIT-10935) SparkFun 7-Segment Serial Display - Red <https://www.sparkfun.com/products/11441> (COM-11441) SparkFun 7-Segment Serial Display - White <https://www.sparkfun.com/products/11629> (COM-11629) SparkFun 7-Segment Serial Display - Yellow <https://www.sparkfun.com/products/11443> (COM-11443) SparkFun 7-Segment Serial Display - Kelly Green <https://www.sparkfun.com/products/11440> (COM-11440) SparkFun 7-Segment Serial Display - Blue <https://www.sparkfun.com/products/11442> (COM-11442) SparkFun OpenSegment Serial Display - 20mm (Blue) <https://www.sparkfun.com/products/11647> (COM-11647) SparkFun OpenSegment Serial Display - 20mm (Green) <https://www.sparkfun.com/products/11646> (COM-11646) SparkFun OpenSegment Serial Display - 20mm (White) <https://www.sparkfun.com/products/11648> (COM-11648) SparkFun OpenSegment Serial Display - 20mm (Red) <https://www.sparkfun.com/products/11644> (COM-11644) SparkFun OpenSegment Serial Display - 20mm (Yellow) <https://www.sparkfun.com/products/11645> (COM-11645) SparkFun OpenSegment Shield <https://www.sparkfun.com/products/13190> (DEV-13190); PROD_ID: IC-09069
U2 = Roboracing:74VHC_MUX
U3 = mike-temp:RFM69
U4 = Roboracing:TUSB8041
U5 = Roboracing:ADP1706ARDZ-1.1-R7
U6 U7 = Roboracing:TPS2561DRCT
U8 = rgb-led:ATTINY441/841
U9 = Roboracing:TXB0108PWR; MANUFACTURER_PART_NUMBER: TXB0108PWR; VENDOR: Texas Instruments
X1 = Roboracing:J12HEADER_(JOULE)
X2 = Roboracing:J13HEADER_(JOULE)
Y1 = SparkFun-Clocks:RESONATOR-16MHZ: 16MHz Resonator Digikey Example <http://www.digikey.com/product-detail/en/murata-electronics-north-america/CSTCE16M0V53-R0/490-1198-1-ND/584635> Frequency: 16MHz Frequency Stability: ±0.3% Frequency Tolerance: ±0.5% Capacitance: 15pF SparkFun Products SparkFun OpenLog <https://www.sparkfun.com/products/13712> SparkFun MicroView - OLED Arduino Module <https://www.sparkfun.com/products/12923>; PROD_ID: XTAL-08900
Y2 = SparkFun-Clocks:CRYSTAL-24MHZ: 24MHz Crystal Datasheet <http://www.sparkfun.com/datasheets/Components/AT-SMD-5x3.pdf> Frequency: 24MHz Frequency Tolerance: ±20ppm Load Capacitance: 12pF SparkFun Products: USB Bit Whacker <https://www.sparkfun.com/products/762>; PROD_ID: XTAL-08298; SF_ID: COM-08581

## Board
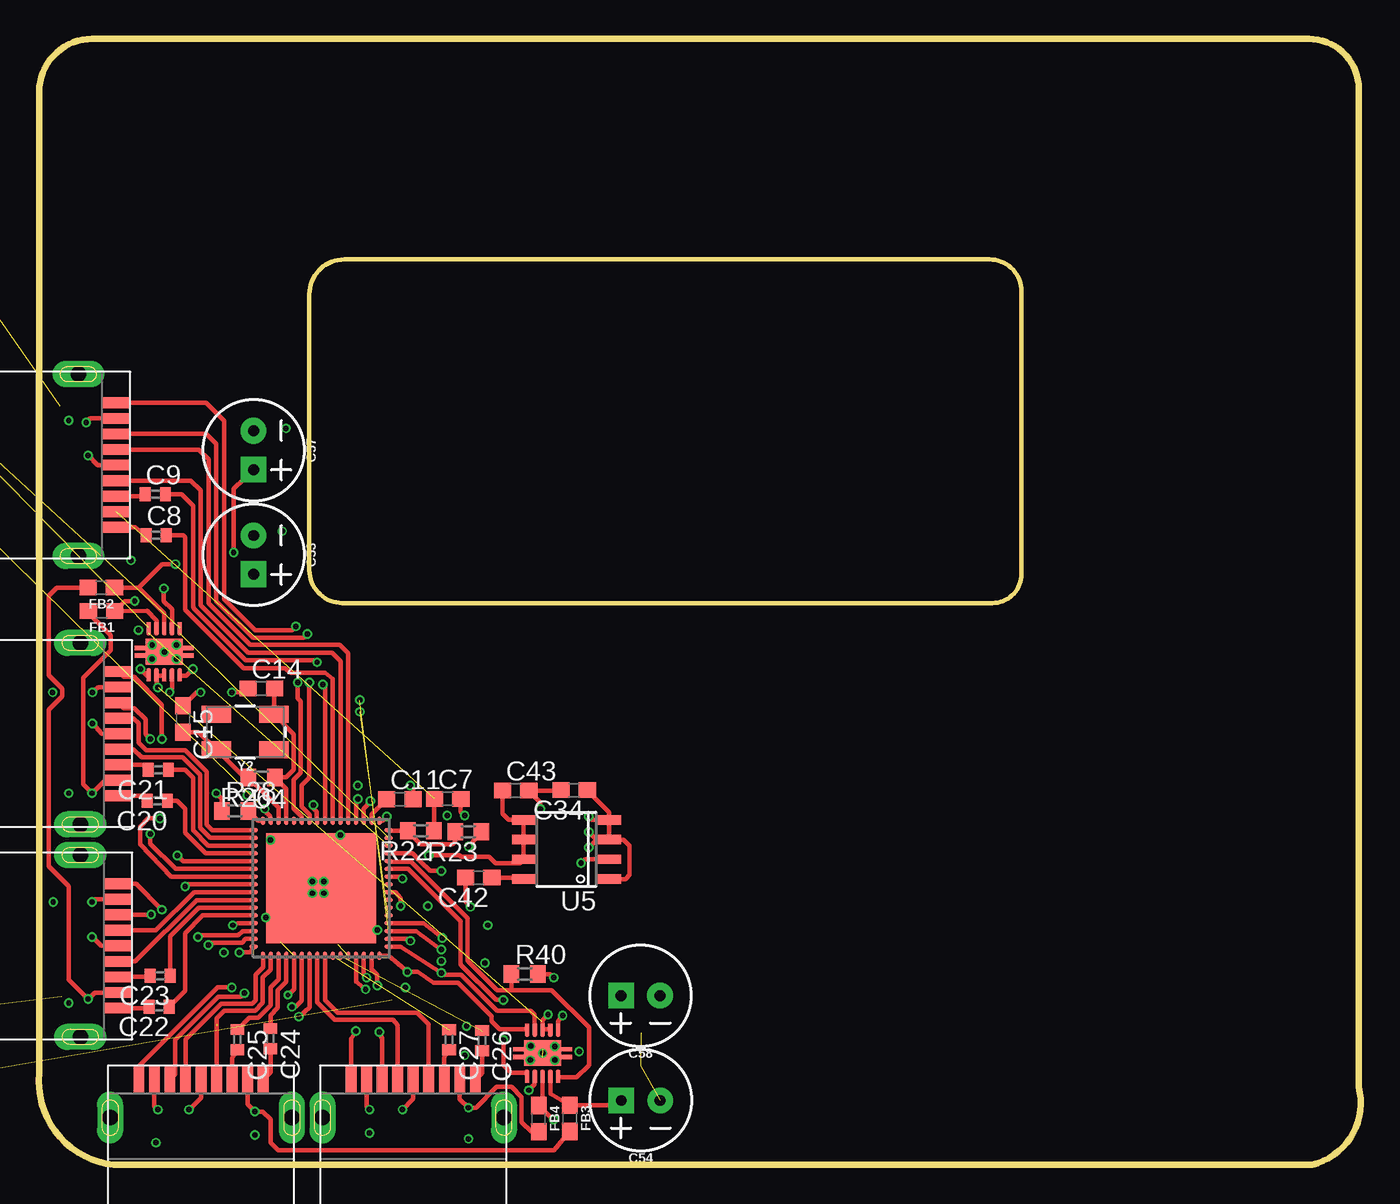
[diagram p3: board, top side]
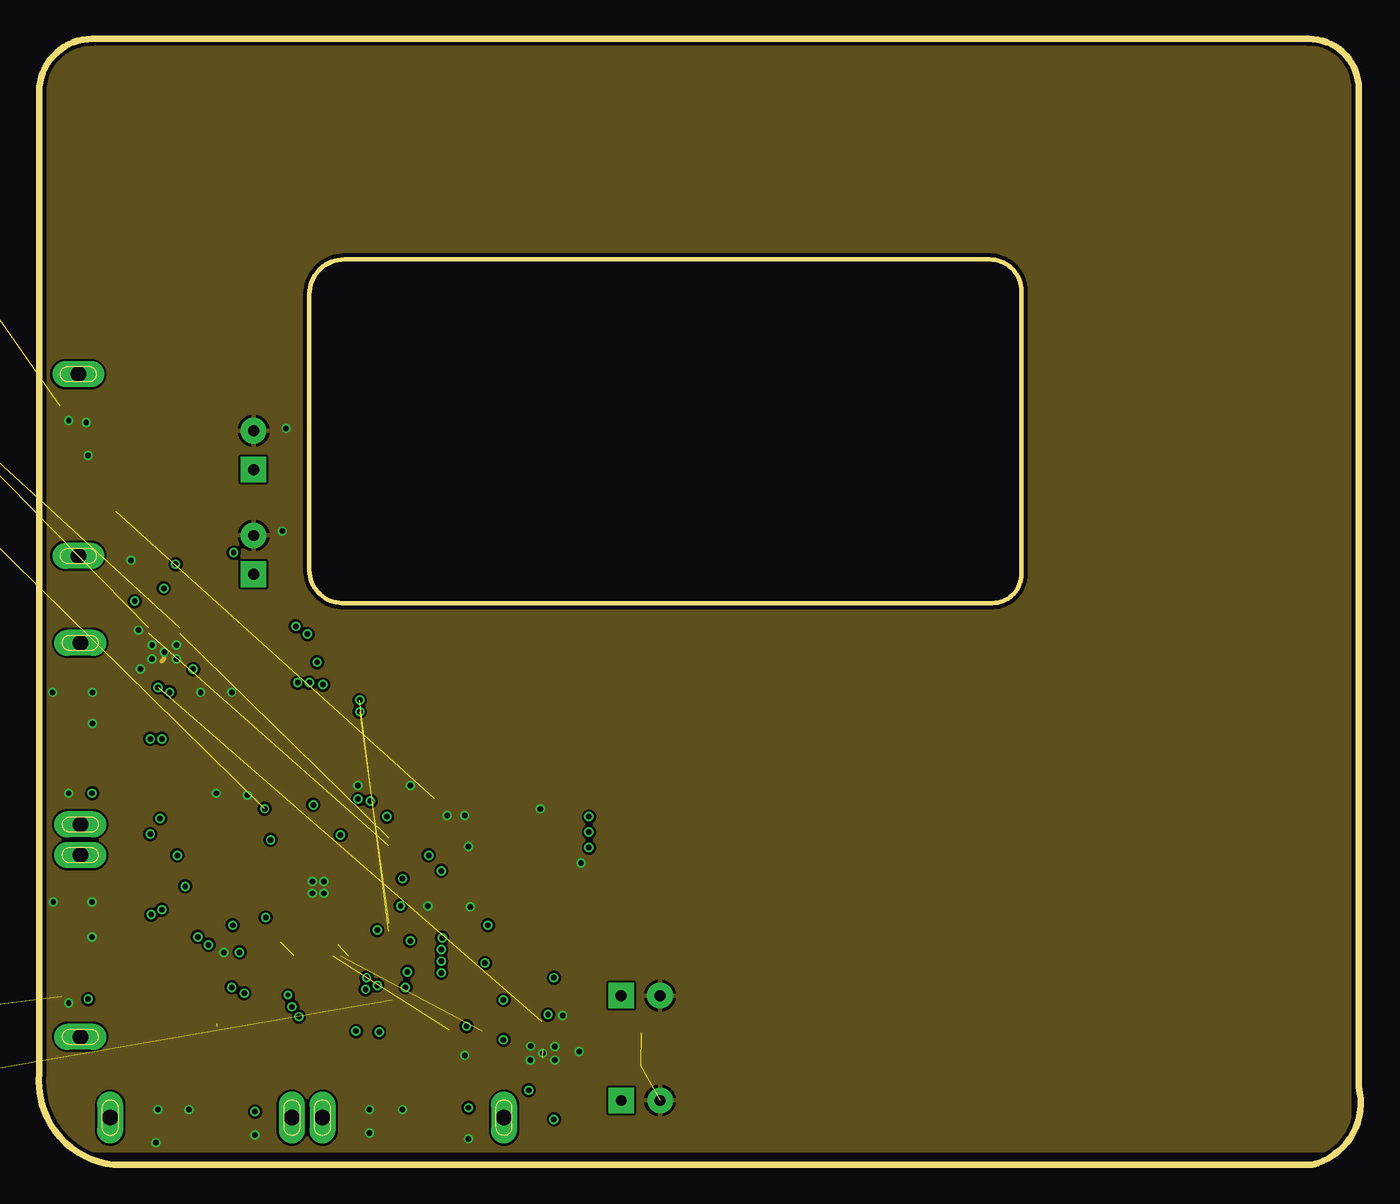
[diagram p4: board, inner layer Route2]
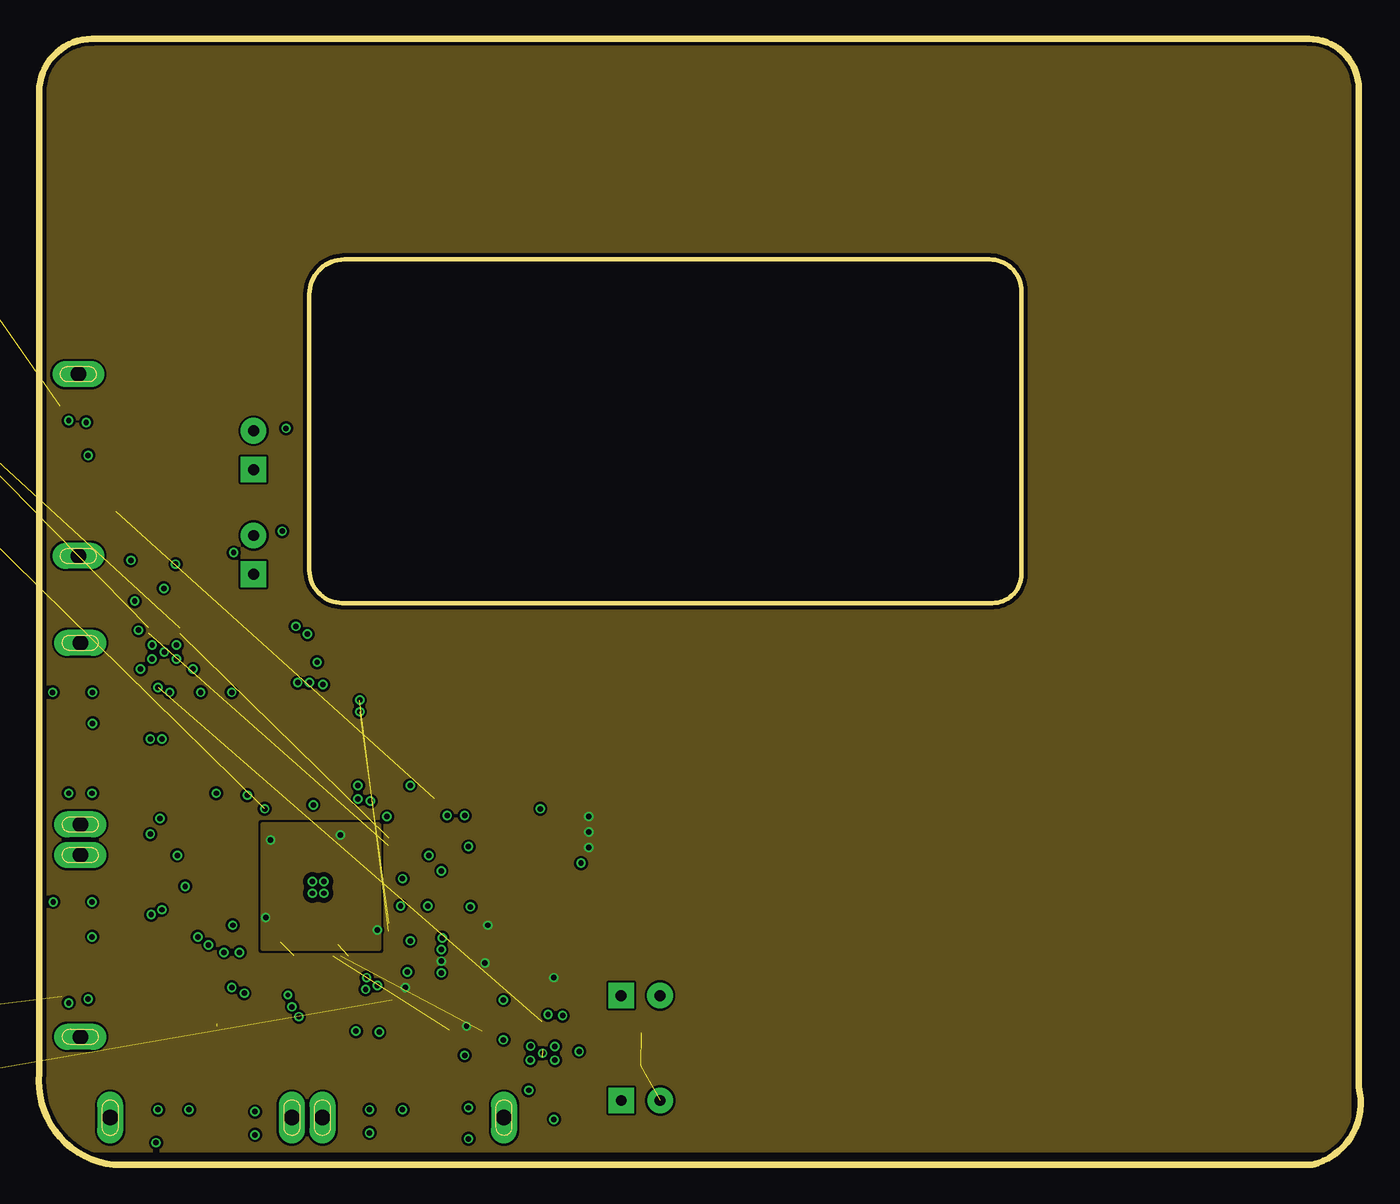
[diagram p5: board, inner layer Route3]
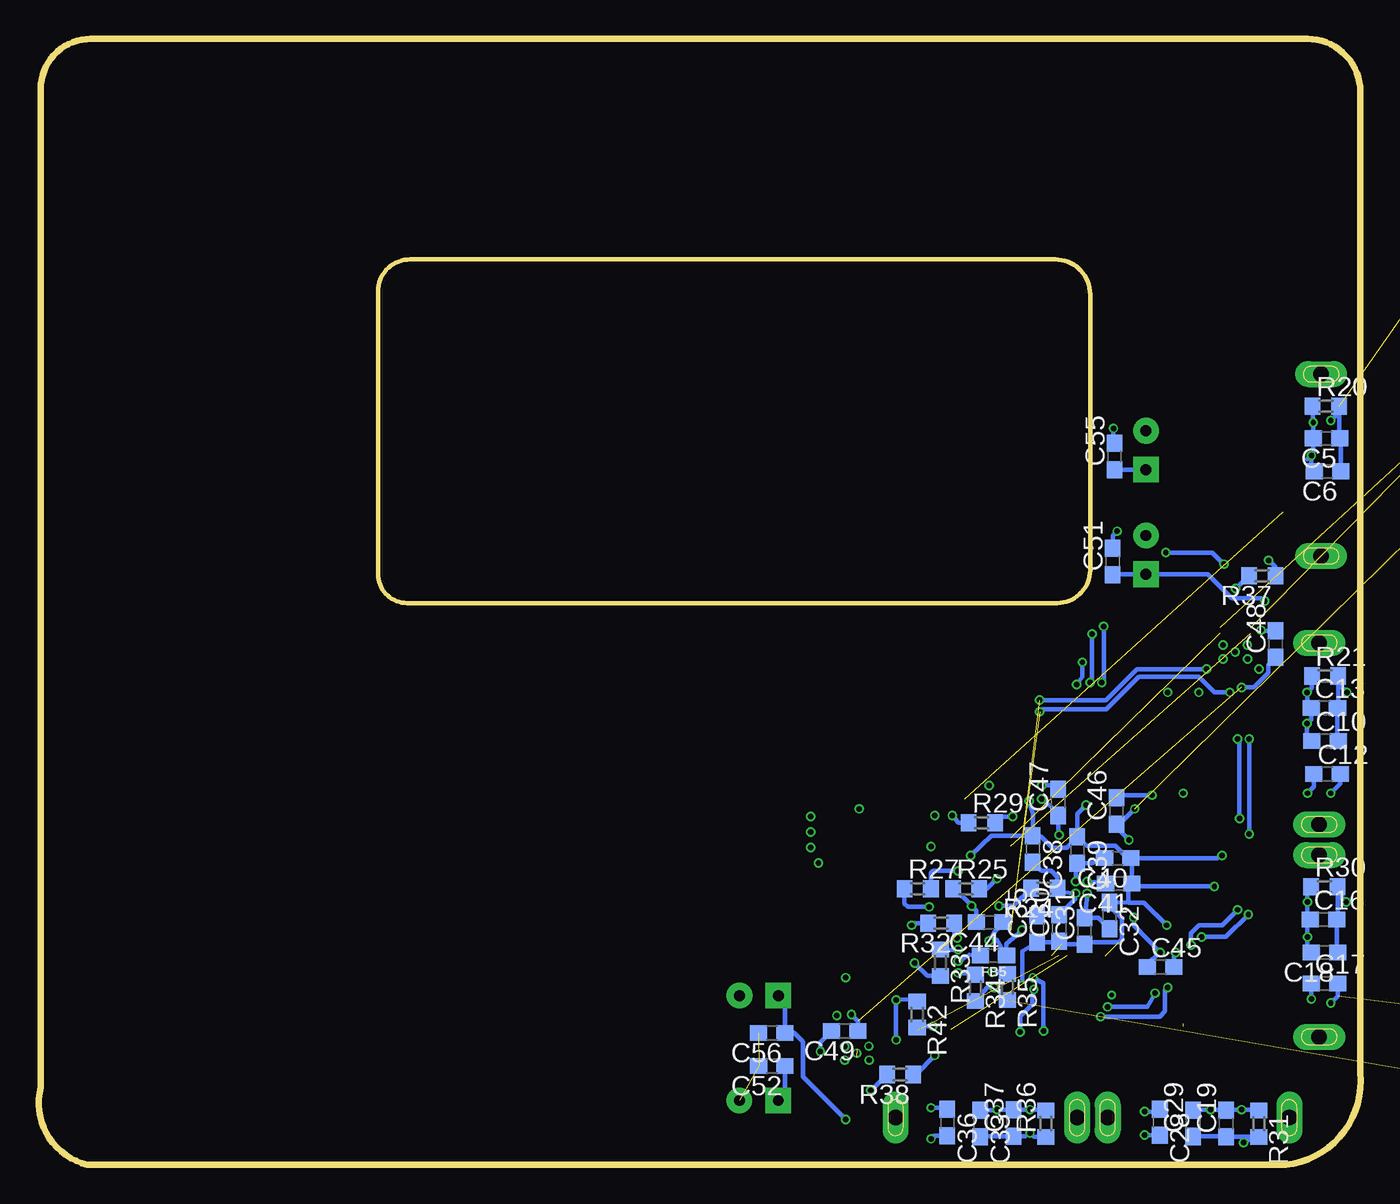
[diagram p6: board, bottom side, seen from below]

Size 85.15 x 72.5 mm. Coordinates in mm from the lower left corner, seen from the top.
Outline: 85.03,5 85.03,69.28 arc90 81.8,72.5 3.44,72.5 arc90 0.03,69.09 0.03,5.91 arc90 4.83,0 82.03,0 arc90 85.03,5
Outline: 61.24,58.3 19.67,58.3 arc90 17.43,56.05 17.43,38.29 arc90 19.54,36.17 61.43,36.17 arc90 63.3,38.05 63.3,56.23 arc90 61.24,58.3
Copper layers (1+2*3+16): Top 0.018mm / dielectric 0.36mm / Route2 0.035mm / dielectric 0.71mm / Route3 0.035mm / dielectric 0.36mm / Bottom 0.018mm
Design rules "eC_4Layer_PClass6_BaseCopperO18-I35_eCDefault": minimum track width 0.15mm, minimum drill 0.35mm, track to track 0.15mm, track to pad 0.15mm, pad to pad 0.15mm, via to via 0.15mm, smd to smd 0mil, copper to edge 0.25mm, drill to drill 0.35mm, minimum pad ring 0.175mm, minimum via ring 0.125mm, stop-mask expansion 0mil, vias tented up to drill 0.45mm, thermal gap 0.2mm

### Footprints (pad centres in the part's own frame; a part is rotated, then mirrored left to right if it is on the bottom)
0603-CAP = smd 1.1 x 1: 1 -0.85,0; 2 0.85,0
0805@1 = smd 0.8 x 1.2: 1 -0.9,0; 2 0.9,0
C0603 = smd 1.1 x 1: 1 -0.85,0; 2 0.85,0
C0402 = smd 0.7 x 0.9: 1 -0.65,0; 2 0.65,0
CPOL-RADIAL-2.5MM-6.5MM = drill 0.7 pad 1.651 square: 1 1.25,0 | drill 0.7 pad 1.651: 2 -1.25,0
LED-0603 = smd 1 x 1: A 0,-0.877; C 0,0.877
1X04 = drill 1.016 long: 1 -3.81,0; 2 -1.27,0; 3 1.27,0; 4 3.81,0
0603 = smd 1.1 x 1: 1 -0.85,0; 2 0.85,0
TO263-3 = smd 1.067 x 2.159: 1 -2.54,-5.791; 2 0,-5.791; 3 2.54,-5.791 | smd 10.8 x 10.41: TAB 0,2.54
2MM-2-V = drill 0.8 square: 1 0,0 | drill 0.8: 2 2,0
1X03 = drill 1.016: 1 -2.54,0; 2 0,0; 3 2.54,0
1X01 = drill 1.016 pad 1.93 octagon: 1 0,0
692112030100 = smd 0.7 x 1.8: 1 -3,0; 2 -1,0; 3 1,0; 4 3,0; 5 4,0; 6 2,0; 7 0,0; 8 -2,0; 9 -4,0 | drill 1 pad 1.676 long: Z1 5.85,2.45; Z2 -5.85,2.45
MO-299A = smd 8.9 x 8.1: DRAIN 0,2.58 | smd 0.8 x 2.8: GATE -4.2,-5.24; P2 -3,-5.24; P3 -1.8,-5.24; P4 -0.6,-5.24; P5 0.6,-5.24; P6 1.8,-5.24; P7 3,-5.24; P8 4.2,-5.24
R0603 = smd 1 x 1.1: 1 -0.85,0; 2 0.85,0
TACTILE_SWITCH_SMD_5.2MM = smd 1.524 x 0.762: 1 -2.794,1.905; 2 2.794,1.905; 3 -2.794,-1.905; 4 2.794,-1.905
TRAXXAS-CON = drill 2.2 square: GND -1.905,0 | drill 2.2: V+ 1.905,0
TQFP32-08 = smd 1.27 x 0.559: 1 -4.293,2.8; 2 -4.293,2; 3 -4.293,1.2; 4 -4.293,0.4; 5 -4.293,-0.4; 6 -4.293,-1.2; 7 -4.293,-2; 8 -4.293,-2.8; 17 4.293,-2.8; 18 4.293,-2; 19 4.293,-1.2; 20 4.293,-0.4; 21 4.293,0.4; 22 4.293,1.2; 23 4.293,2; 24 4.293,2.8 | smd 0.559 x 1.27: 9 -2.8,-4.293; 10 -2,-4.293; 11 -1.2,-4.293; 12 -0.4,-4.293; 13 0.4,-4.293; 14 1.2,-4.293; 15 2,-4.293; 16 2.8,-4.293; 25 2.8,4.293; 26 2,4.293; 27 1.2,4.293; 28 0.4,4.293; 29 -0.4,4.293; 30 -1.2,4.293; 31 -2,4.293; 32 -2.8,4.293
SO16 = smd 0.6 x 1.2: 1 -4.445,-2.8; 2 -3.175,-2.8; 3 -1.905,-2.8; 4 -0.635,-2.8; 5 0.635,-2.8; 6 1.905,-2.8; 7 3.175,-2.8; 8 4.445,-2.8; 9 4.445,2.8; 10 3.175,2.8; 11 1.905,2.8; 12 0.635,2.8; 13 -0.635,2.8; 14 -1.905,2.8; 15 -3.175,2.8; 16 -4.445,2.8
RFM69CW-XXXS2 = smd 3 x 1.2: 1 -7.5,6; 2 -7.5,4; 3 -7.5,2; 4 -7.5,0; 5 -7.5,-2; 6 -7.5,-4; 7 -7.5,-6; 8 7.5,-6; 9 7.5,-4; 10 7.5,-2; 11 7.5,0; 12 7.5,2; 13 7.5,4; 14 7.5,6
QFN64-9X9 = smd 0.55 x 0.25: 1 -4.35,3.75; 2 -4.35,3.25; 3 -4.35,2.75; 4 -4.35,2.25; 5 -4.35,1.75; 6 -4.35,1.25; 7 -4.35,0.75; 8 -4.35,0.25; 9 -4.35,-0.25; 10 -4.35,-0.75; 11 -4.35,-1.25; 12 -4.35,-1.75; 13 -4.35,-2.25; 14 -4.35,-2.75; 15 -4.35,-3.25; 16 -4.35,-3.75; 33 4.35,-3.75; 34 4.35,-3.25; 35 4.35,-2.75; 36 4.35,-2.25; 37 4.35,-1.75; 38 4.35,-1.25; 39 4.35,-0.75; 40 4.35,-0.25; 41 4.35,0.25; 42 4.35,0.75; 43 4.35,1.25; 44 4.35,1.75; 45 4.35,2.25; 46 4.35,2.75; 47 4.35,3.25; 48 4.35,3.75 | smd 0.25 x 0.55: 17 -3.75,-4.35; 18 -3.25,-4.35; 19 -2.75,-4.35; 20 -2.25,-4.35; 21 -1.75,-4.35; 22 -1.25,-4.35; 23 -0.75,-4.35; 24 -0.25,-4.35; 25 0.25,-4.35; 26 0.75,-4.35; 27 1.25,-4.35; 28 1.75,-4.35; 29 2.25,-4.35; 30 2.75,-4.35; 31 3.25,-4.35; 32 3.75,-4.35; 49 3.75,4.35; 50 3.25,4.35; 51 2.75,4.35; 52 2.25,4.35; 53 1.75,4.35; 54 1.25,4.35; 55 0.75,4.35; 56 0.25,4.35; 57 -0.25,4.35; 58 -0.75,4.35; 59 -1.25,4.35; 60 -1.75,4.35; 61 -2.25,4.35; 62 -2.75,4.35; 63 -3.25,4.35; 64 -3.75,4.35 | smd 7.1 x 7.1: EXP 0,0
SOIC8 = smd 0.6 x 1.5: 1 -1.905,-2.75; 2 -0.635,-2.75; 3 0.635,-2.75; 4 1.905,-2.75; 5 1.905,2.75; 6 0.635,2.75; 7 -0.635,2.75; 8 -1.905,2.75
10-VSON = smd 0.28 x 0.71: 1_1 1,1.545; 2_1 0.5,1.545; 3_1 0,1.545; 4_1 -0.5,1.545; 5_1 -1,1.545; 6_1 -1,-1.545; 7_1 -0.5,-1.545; 8_1 0,-1.545; 9_1 0.5,-1.545; 10_1 1,-1.545 | smd 0.28 x 0.28: 1_2 1,1.2; 2_2 0.5,1.2; 3_2 0,1.2; 4_2 -0.5,1.2; 5_2 -1,1.2; 6_2 -1,-1.2; 7_2 -0.5,-1.2; 8_2 0,-1.2; 9_2 0.5,-1.2; 10_2 1,-1.2 | smd 3.8 x 0.28: PAD1 0,0.25; PAD2 0,-0.25 | smd 2.4 x 1.65: PAD3 0,0
SOIC-14 = smd 0.6 x 2.2: 1 -3.81,-2.6; 2 -2.54,-2.6; 3 -1.27,-2.6; 4 0,-2.6; 5 1.27,-2.6; 6 2.54,-2.6; 7 3.81,-2.6; 8 3.81,2.6; 9 2.54,2.6; 10 1.27,2.6; 11 0,2.6; 12 -1.27,2.6; 13 -2.54,2.6; 14 -3.81,2.6
PW20 = smd 1.676 x 0.356: 1 -2.819,2.925; 2 -2.819,2.275; 3 -2.819,1.625; 4 -2.819,0.975; 5 -2.819,0.325; 6 -2.819,-0.325; 7 -2.819,-0.975; 8 -2.819,-1.625; 9 -2.819,-2.275; 10 -2.819,-2.925; 11 2.819,-2.925; 12 2.819,-2.275; 13 2.819,-1.625; 14 2.819,-0.975; 15 2.819,-0.325; 16 2.819,0.325; 17 2.819,0.975; 18 2.819,1.625; 19 2.819,2.275; 20 2.819,2.925
2X20 = drill 1.016 pad 1.651: 1 -24.13,-1.27; 2 -24.13,1.27; 3 -21.59,-1.27; 4 -21.59,1.27; 5 -19.05,-1.27; 6 -19.05,1.27; 7 -16.51,-1.27; 8 -16.51,1.27; 9 -13.97,-1.27; 10 -13.97,1.27; 11 -11.43,-1.27; 12 -11.43,1.27; 13 -8.89,-1.27; 14 -8.89,1.27; 15 -6.35,-1.27; 16 -6.35,1.27; 17 -3.81,-1.27; 18 -3.81,1.27; 19 -1.27,-1.27; 20 -1.27,1.27; 21 1.27,-1.27; 22 1.27,1.27; 23 3.81,-1.27; 24 3.81,1.27; 25 6.35,-1.27; 26 6.35,1.27; 27 8.89,-1.27; 28 8.89,1.27; 29 11.43,-1.27; 30 11.43,1.27; 31 13.97,-1.27; 32 13.97,1.27; 33 16.51,-1.27; 34 16.51,1.27; 35 19.05,-1.27; 36 19.05,1.27; 37 21.59,-1.27; 38 21.59,1.27; 39 24.13,-1.27; 40 24.13,1.27
RESONATOR-SMD-3.2X1.3 = smd 0.45 x 1.905: 1 -1.2,0; 2 0,0; 3 1.2,0
CRYSTAL-SMD-5X3.2-4PAD = smd 1.9 x 1.1: 1 -1.85,-1.15; 2 1.85,-1.15; 3 1.85,1.15; 4 -1.85,1.15

### Placement (x,y rotation side)
C1  -94.32,119.53 0 top  (outside the outline)
C2  -98.13,119.53 0 top  (outside the outline)
C3  -101.94,119.53 0 top  (outside the outline)
C4  -65.11,105.56 0 top  (outside the outline)
C5  2.2,46.78 180 bottom
C6  2.14,44.66 180 bottom
C7  26.33,23.56 0 top
C8  7.56,40.54 0 top
C9  7.5,43.16 0 top
C10  2.29,27.28 0 bottom
C11  23.26,23.53 0 top
C12  2.16,25.16 0 bottom
C13  2.34,29.41 0 bottom
C14  14.33,30.66 0 top
C15  9.29,28.7 270 top
C16  2.4,15.79 0 bottom
C17  2.33,11.66 0 bottom
C18  2.34,13.68 180 bottom
C19  8.67,2.65 90 bottom
C20  7.64,23.43 180 top
C21  7.7,25.43 180 top
C22  7.76,10.18 180 top
C23  7.82,12.18 180 top
C24  14.92,8.12 270 top
C25  12.79,8.05 270 top
C26  28.54,7.99 270 top
C27  26.42,8.05 270 top
C28  12.94,2.73 270 bottom
C29  10.79,2.67 90 bottom
C30  19.42,15.23 90 bottom
C31  17.79,15.05 90 bottom
C32  16.19,16.04 270 bottom
C33  24.5,2.66 270 bottom
C34  34.48,24.12 180 top
C35  20.85,15.19 90 bottom
C36  26.63,2.71 270 bottom
C37  22.35,2.69 90 bottom
C38  21.13,20.34 270 bottom
C39  18.25,20.27 270 bottom
C40  15.64,19.74 180 bottom
C41  15.58,18.12 180 bottom
C42  28.33,18.49 180 top
C43  30.71,24.09 0 top
C44  23.9,15.62 180 bottom
C45  12.89,12.72 0 bottom
C46  15.73,22.77 90 bottom
C47  19.48,23.34 90 bottom
C48  5.48,33.53 90 bottom
C49  33.23,8.62 180 bottom
C50  -79.08,115.72 0 top  (outside the outline)
C51  15.98,38.85 90 bottom
C52  37.92,6.37 180 bottom
C53  13.83,39.27 270 top
C54  38.77,4.14 180 top
C55  15.85,45.61 90 bottom
C56  37.93,8.5 180 bottom
C57  13.83,46.01 270 top
C58  38.76,10.89 180 top
C59  -34.63,106.83 0 top  (outside the outline)
C60  -40.98,106.83 0 top  (outside the outline)
C61  -47.33,106.83 0 top  (outside the outline)
C62  -102.57,-17.08 0 top  (outside the outline)
C63  -102.57,-20.58 0 top  (outside the outline)
D1  -90.51,119.53 0 top  (outside the outline)
ENCODER  -29.55,99.21 0 top  (outside the outline)
FB1  4.05,35.66 180 top
FB2  4.02,37.16 180 top
FB3  34.19,2.99 270 top
FB4  32.19,2.96 270 top
FB5  23.66,13.47 180 bottom
IC2  -49.87,57.3 0 top  (outside the outline)
IC3  -65.11,57.3 0 top  (outside the outline)
IMU  -18.12,99.21 0 top  (outside the outline)
J1  -61.3,91.59 0 top  (outside the outline)
JP1  -46.06,99.21 0 top  (outside the outline)
JP2  -54.95,99.21 0 top  (outside the outline)
JP3  -63.84,99.21 0 top  (outside the outline)
JP4  -72.73,99.21 0 top  (outside the outline)
JP5  -81.62,99.21 0 top  (outside the outline)
JP6  -70.19,91.59 0 top  (outside the outline)
K1  4.99,45.05 90 top
K2  5.12,27.76 90 top
K3  5.12,14.09 90 top
K4  10.45,5.48 180 top
K5  24.12,5.48 180 top
Q1  -37.17,57.3 0 top  (outside the outline)
R1  -101.94,100.48 0 top  (outside the outline)
R2  -19.39,106.83 0 top  (outside the outline)
R3  -93.05,100.48 0 top  (outside the outline)
R20  2.24,48.84 0 bottom
R21  2.3,31.47 0 bottom
R22  24.61,21.49 180 top
R23  27.67,21.44 180 top
R24  20.38,17.81 180 bottom
R25  25.41,17.78 0 bottom
R26  14.35,24.94 180 top
R27  28.53,17.78 0 bottom
R28  12.64,22.78 0 top
R29  24.4,22.03 0 bottom
R30  2.34,17.91 0 bottom
R31  6.57,2.64 270 bottom
R32  27.02,15.56 180 bottom
R33  27.07,13.01 270 bottom
R34  24.82,11.38 270 bottom
R35  22.76,11.44 270 bottom
R36  20.29,2.65 90 bottom
R37  6.35,37.94 180 bottom
R38  29.66,5.81 180 bottom
R39  -75.27,119.53 0 top  (outside the outline)
R40  31.29,12.28 0 top
R41  -82.89,119.53 0 top  (outside the outline)
R42  28.57,9.68 270 bottom
R43  -28.28,106.83 0 top  (outside the outline)
S1  -79.08,91.59 0 top  (outside the outline)
TRAXXAS_ESC_PWR  -27.01,92.86 0 top  (outside the outline)
U1  -87.97,57.3 0 top  (outside the outline)
U2  -98.13,91.59 0 top  (outside the outline)
U3  -84.16,34.44 0 top  (outside the outline)
U4  18.19,17.8 0 top
U5  33.99,20.3 90 top
U6  8.08,33.03 180 top
U7  32.45,7.18 0 top
U8  -19.39,5.23 0 top  (outside the outline)
U9  -51.14,91.59 0 top  (outside the outline)
X1  -38.44,72.54 0 top  (outside the outline)
X2  -38.44,82.7 0 top  (outside the outline)
X4  -42.25,92.86 0 top  (outside the outline)
Y1  -51.14,105.56 0 top  (outside the outline)
Y2  13.3,27.86 180 top

### Tracks (layer width: path | path; a pad name or v marks a point on that pad's centre or on a via)
1.1V  (via drill 0.3, 0.35)  (2 unrouted)
  Top 0.3: U4.13 12.81,15.55 v12.49,15.42 | U4.51 20.94,22.91 v21.37,23.42 | U4.8 9.56,18.05 v9.43,17.92 | U4.57 17.89,22.2 17.89,22.73 17.68,22.94 v17.68,23.17 | U4.31 21.44,12.6 21.8,12.23 v21.8,11.54 | U4.5 9.3,19.55 v8.93,19.92 | v25.12,19.92 27.12,19.92 27.19,19.84 29,19.84 29.43,19.42 30.99,19.42 U5.7 U5.6 U5.5 30.27,22.2 29.86,22.61 C43.1 | U4.21 16.44,11.3 v16.05,10.92
  Bottom 0.3: v12.49,15.42 13.97,16.86 14.95,16.87 | 14.95,16.87 C32.1 16.19,16.66 15.39,15.86 15.39,14.51 15.56,14.34 17.66,14.34 C31.1 19.23,14.2 C30.1 19.22,14.33 C35.1 21.8,13.76 v21.8,11.54 | v21.37,23.42 21.13,22.62 C38.1 | v9.43,17.92 14.53,17.92 C41.1 | v17.68,23.17 18.25,22.59 C39.1 | v8.93,19.92 9.25,19.74 C40.1 | v25.12,19.92 23.79,21.18 22.93,21.18 22.92,21.19 C38.1 | C38.1 20.56,21.12 19.86,20.42 18.93,20.42 18.25,21.09 C39.1 | C40.1 15.02,19.74 15.82,20.55 17.68,20.55 C39.1 | C40.1 14.73,19.69 C41.1 | C41.1 14.94,17.91 | C41.1 14.95,17.9 14.95,16.87
3.3V  (via drill 0.35)  (11 unrouted)
  Top 0.3: R40.2 32.94,12.28 v33.18,12.04 | C34.1 36.74,22.71 U5.4 | U5.4 U5.3 37.66,20.94 38.05,20.55 38.05,18.67 37.78,18.4 U5.1 | v35.43,22.42 35.64,22.2 U5.4 | v35.43,21.42 35.93,20.92 | v35.43,20.42 35.93,20.92 | 35.93,20.92 36.93,20.92
  Bottom 0.3: R35.2 23.43,11.33 v23.62,11.42 24.06,11.42 R34.2 | R33.2 27.92,12.16 v28.74,12.98 | R42.2 28.47,8.92 v27.55,8.92 | R32.2 28.79,15.56 v28.93,15.42 | FB5.2 25.22,13.53 25.68,13.2 25.84,13.07 v25.93,13.11
  pour Route3 (rank 2): 0.43,0.92 84.43,0.92 84.43,71.92 0.43,71.92
5V  (12 unrouted)
+3V3_HUB  (via drill 0.35)  (1 unrouted)
  Top 0.3: U4.34 23.74,14.55 v23.93,14.42 | U4.52 20.44,23.41 v20.55,23.55 | U4.16 13.65,13.67 v12.93,13.67 | U4.63 14.89,22.2 14.89,22.45 14.55,22.79 v14.55,22.92
  Bottom 0.3: C44.1 23.62,14.93 v23.93,14.42 23.45,14.48 FB5.1 22.81,14.23 v21.8,15.11 | v20.55,23.55 19.5,22.74 C47.1 19.48,21.28 v19.43,21.23 | C45.1 13.74,12.92 v12.93,13.67 14.62,15.42 v14.62,15.92 | v14.55,22.92 15.55,21.92 C46.1 15.73,21.72 v14.93,20.92
  pour Route3 (isolate 0.3): 14.43,21.92 21.93,21.92 21.93,13.92 14.43,13.92
+5V  (via drill 0.35)  (1 unrouted)
  Top 0.3: U7.2_2 U7.2_1 U7.3_1 | U7.3_2 U7.3_1 | U7.3_1 32.45,9.31 v32.8,9.67 | U6.2_2 U6.2_1 | U6.3_2 U6.3_1 U6.2_1 | U6.2_1 7.58,30.77 v7.68,30.73
  Bottom 0.3: v32.8,9.67 32.38,9.25 C49.1 | C48.1 5.95,32.2 5.95,31.67 6.89,30.73 v7.68,30.73
DIO0_3V3  (1 unrouted)
DN1_VBUS  (via drill 0.35)
  Top 0.3: U6.9_2 U6.9_1 7.58,35.04 6.97,35.67 FB1.1 5.54,36.3 v6.18,36.3
  Bottom 0.3: v6.18,36.3 6.35,36.47 8.29,36.47 9.84,38.02 C53.1 15.96,38.02 C51.1
DN2_VBUS  (via drill 0.35)
  Top 0.3: U6.8_2 U6.8_1 8.08,35.52 6.44,37.16 6.43,37.16 | 6.43,37.16 FB2.1 | 6.43,37.16 7.94,38.67 v8.8,38.67 | v12.55,39.42 12.55,43.54 C57.1
  Bottom 0.3: v8.8,38.67 9.55,39.42 v12.55,39.42 | C57.1 C55.1
DN3_VBUS
  Top 0.3: C54.1 37.22,3.84 FB3.1 32.95,4.58 U7.9_1 U7.9_2
  Bottom 0.3: C54.1 37.07,4.59 C52.1
DN4_VBUS  (via drill 0.35)
  Top 0.3: U7.8_2 U7.8_1 32.45,4.07 FB4.1 33.09,2.92 v33.18,2.92
  Bottom 0.3: C58.1 37.08,10.46 C56.1 36.5,8.5 35.93,7.92 35.93,5.67 v33.18,2.92
ESTOP_3V3  (1 unrouted)
ESTOP_5V  (1 unrouted)
ESTOP_GATE  (2 unrouted)
GND  (via drill 0.35)  (54 unrouted)
  Top 0.3: K3.7 4.01,14.09 v3.43,14.67 | K3.4 3.6,17.09 v3.43,16.92 | K2.7 4.06,27.76 v3.47,28.42 | v3.45,30.42 3.82,30.76 K2.4 | K1.4 3.31,48.05 v3.05,47.8 | K1.7 3.79,45.05 v3.18,45.67 | K4.4 7.45,3.77 v7.68,3.54 | K4.7 10.45,4.31 v9.68,3.54 | K5.4 21.12,3.73 v21.3,3.54 | K5.7 24.12,4.23 v23.43,3.54 | R28.1 11.79,23.56 v11.43,23.92 | C15.1 10.16,30.42 v10.43,30.42 | C14.1 13.24,30.42 v12.43,30.42 | R23.1 28.07,20.92 v27.68,20.48 | v33.74,9.61 33.45,9.25 U7.1_1 U7.1_2 | v6.55,31.92 6.99,31.48 U6.1_1 U6.1_2 | C11.2 24.11,24.24 v23.93,24.42 | C7.2 27.18,22.73 v27.43,22.48 | v32.3,22.92 32.3,23.35 C43.2 33.6,24.09 C34.2 | U5.2 35.17,19.66 v34.93,19.42 | C42.2 27.48,16.93 v27.8,16.61 | U4.EXP 18.19,17.66 v18.37,17.48 | v8.08,33.02 U6.PAD3 | v8.08,33.02 U6.PAD1 | U6.PAD2 v8.08,33.02
  Route2 0.3: U6.PAD3 v8.08,33.02 8.08,32.57 7.93,32.42
  Bottom 0.3: v0.93,16.92 1.49,17.48 R30.2 1.49,15.85 C16.2 1.55,13.74 C18.1 | C18.2 3.43,13.92 v3.43,14.67 3.43,15.92 2.93,15.92 | C16.1 3.43,15.96 v3.43,16.92 3.43,17.66 R30.1 | C17.2 1.48,10.87 v1.93,10.42 | 1.45,30.94 v0.89,30.42 | R21.2 1.45,30.94 | 1.45,30.94 1.45,29.45 C13.2 1.49,27.34 C10.2 | C10.1 3.47,27.58 v3.47,28.42 3.19,28.66 C13.1 | R21.1 3.15,30.7 v3.45,30.42 3.45,29.92 2.93,29.42 | C12.2 1.31,24.54 v1.93,23.92 | R20.1 3.09,47.83 v3.05,47.8 C5.2 3.05,45.8 3.43,45.42 | v3.18,45.67 3.18,44.84 C6.2 | C6.1 1.29,46.72 C5.1 1.39,46.82 R20.2 1.39,48.46 v1.93,47.92 | R31.1 6.62,3.54 v7.68,3.54 8.62,3.54 C19.2 8.72,3.54 v9.68,3.54 10.77,3.54 C29.2 10.77,3.5 | v7.55,1.42 7.43,1.42 7.06,1.79 R31.2 C19.1 8.69,1.82 C29.1 | C28.2 13.89,1.89 v13.93,1.92 | R36.2 20.33,3.54 v21.3,3.54 C37.2 v23.43,3.54 23.46,3.51 C33.1 | R36.1 21.05,1.8 v21.3,2.04 21.6,1.84 C37.1 24.47,1.84 C33.2 | C36.2 27.48,1.86 v27.68,1.67 | C47.2 19.71,24.42 v20.55,24.42 | C45.2 12.04,13.37 v11.93,13.67 | C49.2 34.8,7.89 v34.8,7.29 | R38.1 28.66,5.81 v27.43,7.04 | C44.2 24.75,16.37 v25.05,16.67 26.16,17.78 R25.1 | R27.1 29.38,16.81 29.18,16.61 v27.8,16.61 | C55.2 15.93,46.53 v15.93,47.42 | C41.2 16.48,18.17 v17.62,18.23 | v18.37,18.23 18.3,19.37 C39.2 17.32,19.42 C40.2 | v17.62,17.48 17.68,16.79 C31.2 16.9,15.9 C32.2 | C35.2 21.18,16.09 C30.2 18.37,17.14 v18.37,17.48 19.26,17.55 R24.1 19.53,18.52 19.93,18.92 20.56,18.92 C38.2 | C46.2 15.56,23.8 v13.43,23.8 | R29.1 25.91,22.03 v26.3,22.48 | C51.2 15.98,40.5 v15.68,40.8 | R37.1 5.5,38.49 v5.93,38.92 | C48.2 6.39,34.38 v6.43,34.42
  other vias: 31.68,7.63 31.67,6.73 32.45,7.18 33.24,6.73 33.24,7.62 7.3,33.47 7.29,32.57 8.87,32.57 8.87,33.46
  pour Route2: 0.43,0.92 84.43,0.92 84.43,71.92 0.43,71.92
GRST#
  Top 0.3: U4.50 21.44,22.56 C11.1
I2C0_SCL  (1 unrouted)
I2C0_SDA  (1 unrouted)
ILIM1  (via drill 0.35)
  Top 0.3: v8.05,37.11 8.05,36.3 8.58,35.77 U6.7_1 U6.7_2
  Bottom 0.3: v8.05,37.11 7.2,37.9 R37.2
ILIM2  (via drill 0.35)
  Top 0.3: v31.55,4.79 31.95,5.19 U7.7_1 U7.7_2
  Bottom 0.3: v31.55,4.79 31.53,4.79 R38.2
MISO_3V3  (1 unrouted)
MISO_5V  (1 unrouted)
MISO_JOULE  (1 unrouted)
MODE_SELECT_3V3  (1 unrouted)
MODE_SELECT_5V  (1 unrouted)
MOSI_3V3  (1 unrouted)
MOSI_5V  (1 unrouted)
MOSI_JOULE  (1 unrouted)
N$1  (1 unrouted)
N$2  (1 unrouted)
N$3  (1 unrouted)
N$4  (2 unrouted)
N$6  (1 unrouted)
N$7  (4 unrouted)
N$8  (1 unrouted)
N$9
  Top 0.3: U4.64 14.12,22.15 R28.2
N$10  (1 unrouted)
N$11  (1 unrouted)
N$12  (1 unrouted)
N$13  (1 unrouted)
N$18  (via drill 0.35)
  Top 0.3: U4.49 22.16,22.15 v22.43,22.42
  Bottom 0.3: v22.43,22.42 23.16,22.42 R29.2
N$20  (1 unrouted)
N$22  (via drill 0.35)
  Top 0.3: U4.45 24.07,20.05 24.56,19.56 25.2,18.92 v25.93,18.92
  Bottom 0.3: R27.2 27.68,18.79 27.55,18.92 v25.93,18.92
N$23  (via drill 0.35)
  Top 0.3: U4.42 23.3,18.55 v23.43,18.42
  Bottom 0.3: v23.43,18.42 24.07,17.78 R25.2
N$24  (via drill 0.35)
  Top 0.3: v23.3,16.67 23.3,17.16 22.98,17.55 U4.40
  Bottom 0.3: v23.3,16.67 22.37,16.67 R24.2
N$25
  Top 0.3: U4.48 22.59,21.49 R22.2 24.61,20.65 25.93,20.65 | 26.08,20.65 25.93,20.65 | 25.93,20.65 26.65,20.65 26.82,20.81 R23.2
N$26  (1 unrouted)
N$27  (1 unrouted)
N$28
  Top 0.3: C25.1 13.56,9.47 14.11,9.47 14.93,10.28 14.93,11.42 15.44,11.93 U4.19
N$29
  Top 0.3: C24.1 14.92,9.64 15.38,10.1 15.38,11.23 15.94,11.79 U4.20
N$30
  Top 0.3: C23.1 8.47,14.71 10.31,16.55 U4.11
N$31
  Top 0.3: C22.1 9.43,11.2 9.43,14.92 10.56,16.05 U4.12
N$32
  Top 0.3: C21.1 9.42,25.43 9.93,24.92 9.93,21.52 10.9,20.55 U4.3
N$33
  Top 0.3: C20.1 8.92,23.43 9.43,22.92 9.43,21.39 10.76,20.05 U4.4
N$35  (via drill 0.35)
  Top 0.3: K2.1 4.27,24.76 v3.43,23.92 2.85,24.49 2.85,31.35 4.64,33.14 4.64,34.08 3.2,35.53 FB1.2
  Bottom 0.3: v3.43,23.92 3.01,24.34 C12.1
N$36
  Top 0.3: C42.1 31.14,18.49 U5.8
N$38  (via drill 0.35)
  Top 0.3: K3.1 3.6,11.09 v3.18,10.67 1.93,11.92 1.93,17.92 0.63,19.22 0.63,29.31 1.5,30.18 1.5,30.66 0.63,31.53 0.63,36.62 1.16,37.16 FB2.2
  Bottom 0.3: v3.18,10.67 C17.1
N$40  (via drill 0.35)
  Top 0.3: K4.1 13.45,3.9 v13.93,3.42 14.43,3.42 14.93,2.92 14.93,1.42 15.43,0.92 33.18,0.92 33.19,0.93 FB3.2
  Bottom 0.3: v13.93,3.42 13.1,3.42 C28.1
N$73  (via drill 0.35)
  Top 0.3: K5.1 27.12,4.23 v27.68,3.67 28.16,3.67 29.5,5.01 30.44,5.01 31.11,4.34 31.11,2.74 31.73,2.11 FB4.2
  Bottom 0.3: v27.68,3.67 26.73,3.67 C36.1
NSS_3V3  (1 unrouted)
NSS_5V  (1 unrouted)
OVERCUR1Z  (2 unrouted)
  Top 0.3: U6.10_1 U6.10_2
OVERCUR2Z  (2 unrouted)
  Top 0.3: U6.6_1 U6.6_2
OVERCUR3Z
  Top 0.3: U4.44 22.59,19.5 23.98,19.5 27.63,15.86 27.63,13.14 29.52,11.24 30.44,11.24 | 30.44,11.24 33.04,11.24 35.43,8.86 35.43,6.42 34.65,5.64 U7.10_1 U7.10_2 | R40.1 30.44,11.24
OVERCUR4Z  (via drill 0.35)
  Top 0.3: U4.43 23.8,19.05 27.18,15.67 27.18,12.89 29.46,10.61 v29.93,10.61 | v29.93,8.04 29.93,6.42 30.43,5.92 31.38,5.92 U7.6_2 U7.6_1
  Bottom 0.3: v29.93,8.04 v29.93,10.61 28.71,10.67 R42.1
PC_PWM_SERVO  (1 unrouted)
PC_PWM_THROTTLE  (1 unrouted)
PWRCTL1_BATEN1  (via drill 0.35)  (1 unrouted)
  Top 0.3: U4.36 24.8,15.55 v25.99,14.61 | v8.43,30.42 8.43,30.55 8.58,30.7 U6.4_1 U6.4_2
  Bottom 0.3: v25.99,14.61 26.17,14.79 R32.1 | v8.43,30.42 9.43,30.42 10.43,31.42 14.29,31.42 16.37,29.34 20.5,29.34 v20.68,29.17
PWRCTL2_BATEN2  (via drill 0.35)  (1 unrouted)
  Top 0.3: U4.35 24.3,15.05 v25.93,13.86 | v9.93,31.92 9.49,31.48 U6.5_1 U6.5_2
  Bottom 0.3: v25.93,13.86 26.63,13.79 R33.1 | v9.93,31.92 14.43,31.92 16.43,29.92 v20.68,29.92
PWRCTL3_BATEN3  (via drill 0.35)
  Top 0.3: U4.33 23.3,14.05 v25.93,12.36 26.18,12.23 27.2,12.23 29.51,9.92 31.68,9.92 31.95,9.65 U7.4_1 U7.4_2
  Bottom 0.3: R34.1 v25.93,12.36
PWRCTL4_BATEN4  (via drill 0.35)
  Top 0.3: U7.5_2 U7.5_1 29.68,8.73 29.16,9.25 29.16,9.58 27.01,11.72 25.44,11.72 24.39,12.42 v23.74,12.42 22.52,13.45 U4.32
  Bottom 0.3: v23.74,12.42 22.63,12.42 R35.1
RC_CH3_3V3  (1 unrouted)
RC_CH3_5V  (1 unrouted)
SCK_3V3  (1 unrouted)
SCK_5V  (1 unrouted)
SCK_JOULE  (1 unrouted)
USB_DM_DN1
  Top 0.3: K2.2 6.09,26.76 6.62,26.23 9.25,26.23 10.38,25.11 10.38,21.71 11.04,21.05 U4.2
USB_DM_DN2
  Top 0.3: K3.2 6.21,13.09 10.17,17.05 U4.10
USB_DM_DN3  (1 unrouted)
  Top 0.3: K4.2 11.45,9.08 | U4.18 14.94,12.57 14.43,12.06 14.43,10.42 13.93,9.92 11.93,9.92 11.45,9.44 11.45,8.92
USB_DM_DN4
  Top 0.3: K5.2 25.12,9.04 24.38,9.78 19.24,9.78 18.44,10.59 U4.25
USB_DP_DN1
  Top 0.3: K2.3 6.09,28.76 6.43,28.42 6.43,27.18 6.93,26.68 9.44,26.68 10.83,25.29 10.83,21.9 11.18,21.55 U4.1
USB_DP_DN2
  Top 0.3: K3.3 7.52,15.09 10.02,17.55 U4.9
USB_DP_DN3
  Top 0.3: U4.17 14.44,12.7 13.98,12.24 13.98,10.61 13.74,10.37 11.74,10.37 9.45,8.08 K4.3
USB_DP_DN4
  Top 0.3: U4.24 17.94,10.45 19.06,9.33 22.83,9.33 23.12,8.98 K5.3
USB_SSRXM_DN1  (via drill 0.35)
  Top 0.3: K2.5 5.47,31.41 6.14,31.41 7.93,29.62 v7.93,27.42 | v7.8,22.3 7.05,22.3 6.53,21.77 6.53,20.62 8.54,18.55 U4.7
  Bottom 0.3: v7.93,27.42 7.8,27.3 v7.8,22.3
USB_SSRXM_DN2  (via drill 0.35)
  Top 0.3: K3.5 6.26,18.09 v7.93,16.42 | U4.15 13.34,14.55 13.08,14.29 11.12,14.29 v10.93,14.16
  Bottom 0.3: v7.93,16.42 8.93,15.42 10.43,15.42 10.93,14.92 v10.93,14.16
USB_SSRXM_DN3  (via drill 0.35)
  Top 0.3: U4.23 17.44,10.15 v16.75,9.53 | K4.5 6.45,6.35 11.52,11.42 v12.43,11.42
  Bottom 0.3: v12.43,11.42 12.6,11.24 12.6,9.87 12.94,9.53 v16.75,9.53
USB_SSRXM_DN4  (via drill 0.35)
  Top 0.3: K5.5 20.12,8.11 v20.43,8.61 | U4.30 20.93,12.23 v21.12,12.04
  Bottom 0.3: v20.43,8.61 20.43,11.67 v21.12,12.04
USB_SSRXP_DN1  (via drill 0.35)
  Top 0.3: v7.18,27.42 6.88,27.72 6.88,28.67 6.14,29.41 5.47,29.41 K2.6 | v7.18,21.3 7.18,20.67 8.8,19.05 U4.6
  Bottom 0.3: v7.18,27.42 v7.18,21.3
USB_SSRXP_DN2  (via drill 0.35)
  Top 0.3: K3.6 7.26,16.09 v7.24,16.11 | U4.14 13.12,15.05 12.85,14.78 10.48,14.78 v10.24,14.67
  Bottom 0.3: v7.24,16.11 8.68,14.67 v10.24,14.67
USB_SSRXP_DN3  (via drill 0.35)
  Top 0.3: K4.6 8.8,5.83 8.8,8.06 11.56,10.82 13.02,10.82 v13.24,11.04 | v16.3,10.17 16.55,10.17 16.93,10.54 U4.22
  Bottom 0.3: v13.24,11.04 13.74,10.17 v16.3,10.17
USB_SSRXP_DN4  (via drill 0.35)
  Top 0.3: K5.6 22.12,8.11 v21.93,8.54 | v21.05,11.29 20.44,11.79 U4.29
  Bottom 0.3: v21.05,11.29 21.16,10.69 21.16,10.34 21.93,9.57 v21.93,8.54
USB_SSTXM_DN1
  Top 0.3: K2.8 6.72,25.76 C21.2
USB_SSTXM_DN2
  Top 0.3: K3.8 6.88,12.09 C23.2
USB_SSTXM_DN3
  Top 0.3: K4.8 12.45,6.86 C25.2
USB_SSTXM_DN4
  Top 0.3: K5.8 26.12,6.9 C27.2
USB_SSTXP_DN1
  Top 0.3: K2.9 6.66,23.76 C20.2
USB_SSTXP_DN2
  Top 0.3: K3.9 6.82,10.09 C22.2
USB_SSTXP_DN3
  Top 0.3: K4.9 14.92,5.95 C24.2
USB_SSTXP_DN4
  Top 0.3: K5.9 28.54,5.91 C26.2
USBA_USB2_1_DN
  Top 0.3: K1.2 9.79,44.05 10.43,43.42 10.43,36.01 13.47,32.97 18.88,32.97 19.43,32.42 U4.54
USBA_USB2_1_DP
  Top 0.3: K1.3 10.29,46.05 10.93,45.42 10.93,36.15 13.61,33.47 19.38,33.47 19.93,32.92 19.93,24.92 19.93,24.73 U4.53
USBA_USB3_1_RX_DN  (via drill 0.35)
  Top 0.3: K1.5 10.79,49.05 11.93,47.92 11.93,36.42 13.93,34.42 16.3,34.42 v16.55,34.67 | U4.59 16.94,22.41 16.43,22.92 16.43,24.78 16.88,25.23 16.88,29.85 16.68,30.05 v16.68,31.05
  Bottom 0.3: v16.55,34.67 16.55,31.17 v16.68,31.05
USBA_USB3_1_RX_DP  (via drill 0.35)
  Top 0.3: K1.6 10.79,47.05 11.43,46.42 11.43,36.28 13.79,33.92 17.05,33.92 v17.3,34.17 | v17.44,31.03 v17.43,31.05 17.43,24.92 16.93,24.42 16.93,23.06 17.44,22.55 U4.58
  Bottom 0.3: v17.3,34.17 17.3,31.17 v17.43,31.05
USBA_USB3_1_TX_DN
  Top 0.3: K1.8 6.55,43.05 C9.1
USBA_USB3_1_TX_DP
  Top 0.3: K1.9 6.19,41.05 C8.1
V1P8V  (1 unrouted)
V3P3V  (1 unrouted)
V5P0V  (1 unrouted)
VBUS_HUB  (1 unrouted)
  Top 0.3: R22.1 25.46,23.53 C7.1
VCC  (4 unrouted)
X
  Top 0.3: C8.2 9.31,40.54 9.43,40.42 9.43,35.74 13.2,31.97 15.88,31.97 16.18,31.67 18.43,31.67 18.93,31.3 U4.55
XI
  Top 0.3: U4.62 15.44,22.99 R26.2 13.22,24.94 Y2.3 10.3,27.85 C15.2
XO
  Top 0.3: U4.61 15.94,24.2 R26.1 15.94,24.94 16.43,25.42 16.43,27.73 Y2.1 15.15,30.63 C14.2
Y  (via drill 0.35)
  Top 0.3: C9.2 9.19,43.16 9.93,42.42 9.93,35.92 9.98,35.87 9.98,35.82 13.33,32.47 17.88,32.47 v17.93,32.36 | v18.3,30.92 18.44,30.78 U4.56
  Bottom 0.3: v17.93,32.36 17.93,31.42 v18.3,30.92